# Altium project S7CAS-PLEIADES-CARTE-MERE_P02.PrjPCB (part 1 of 3)
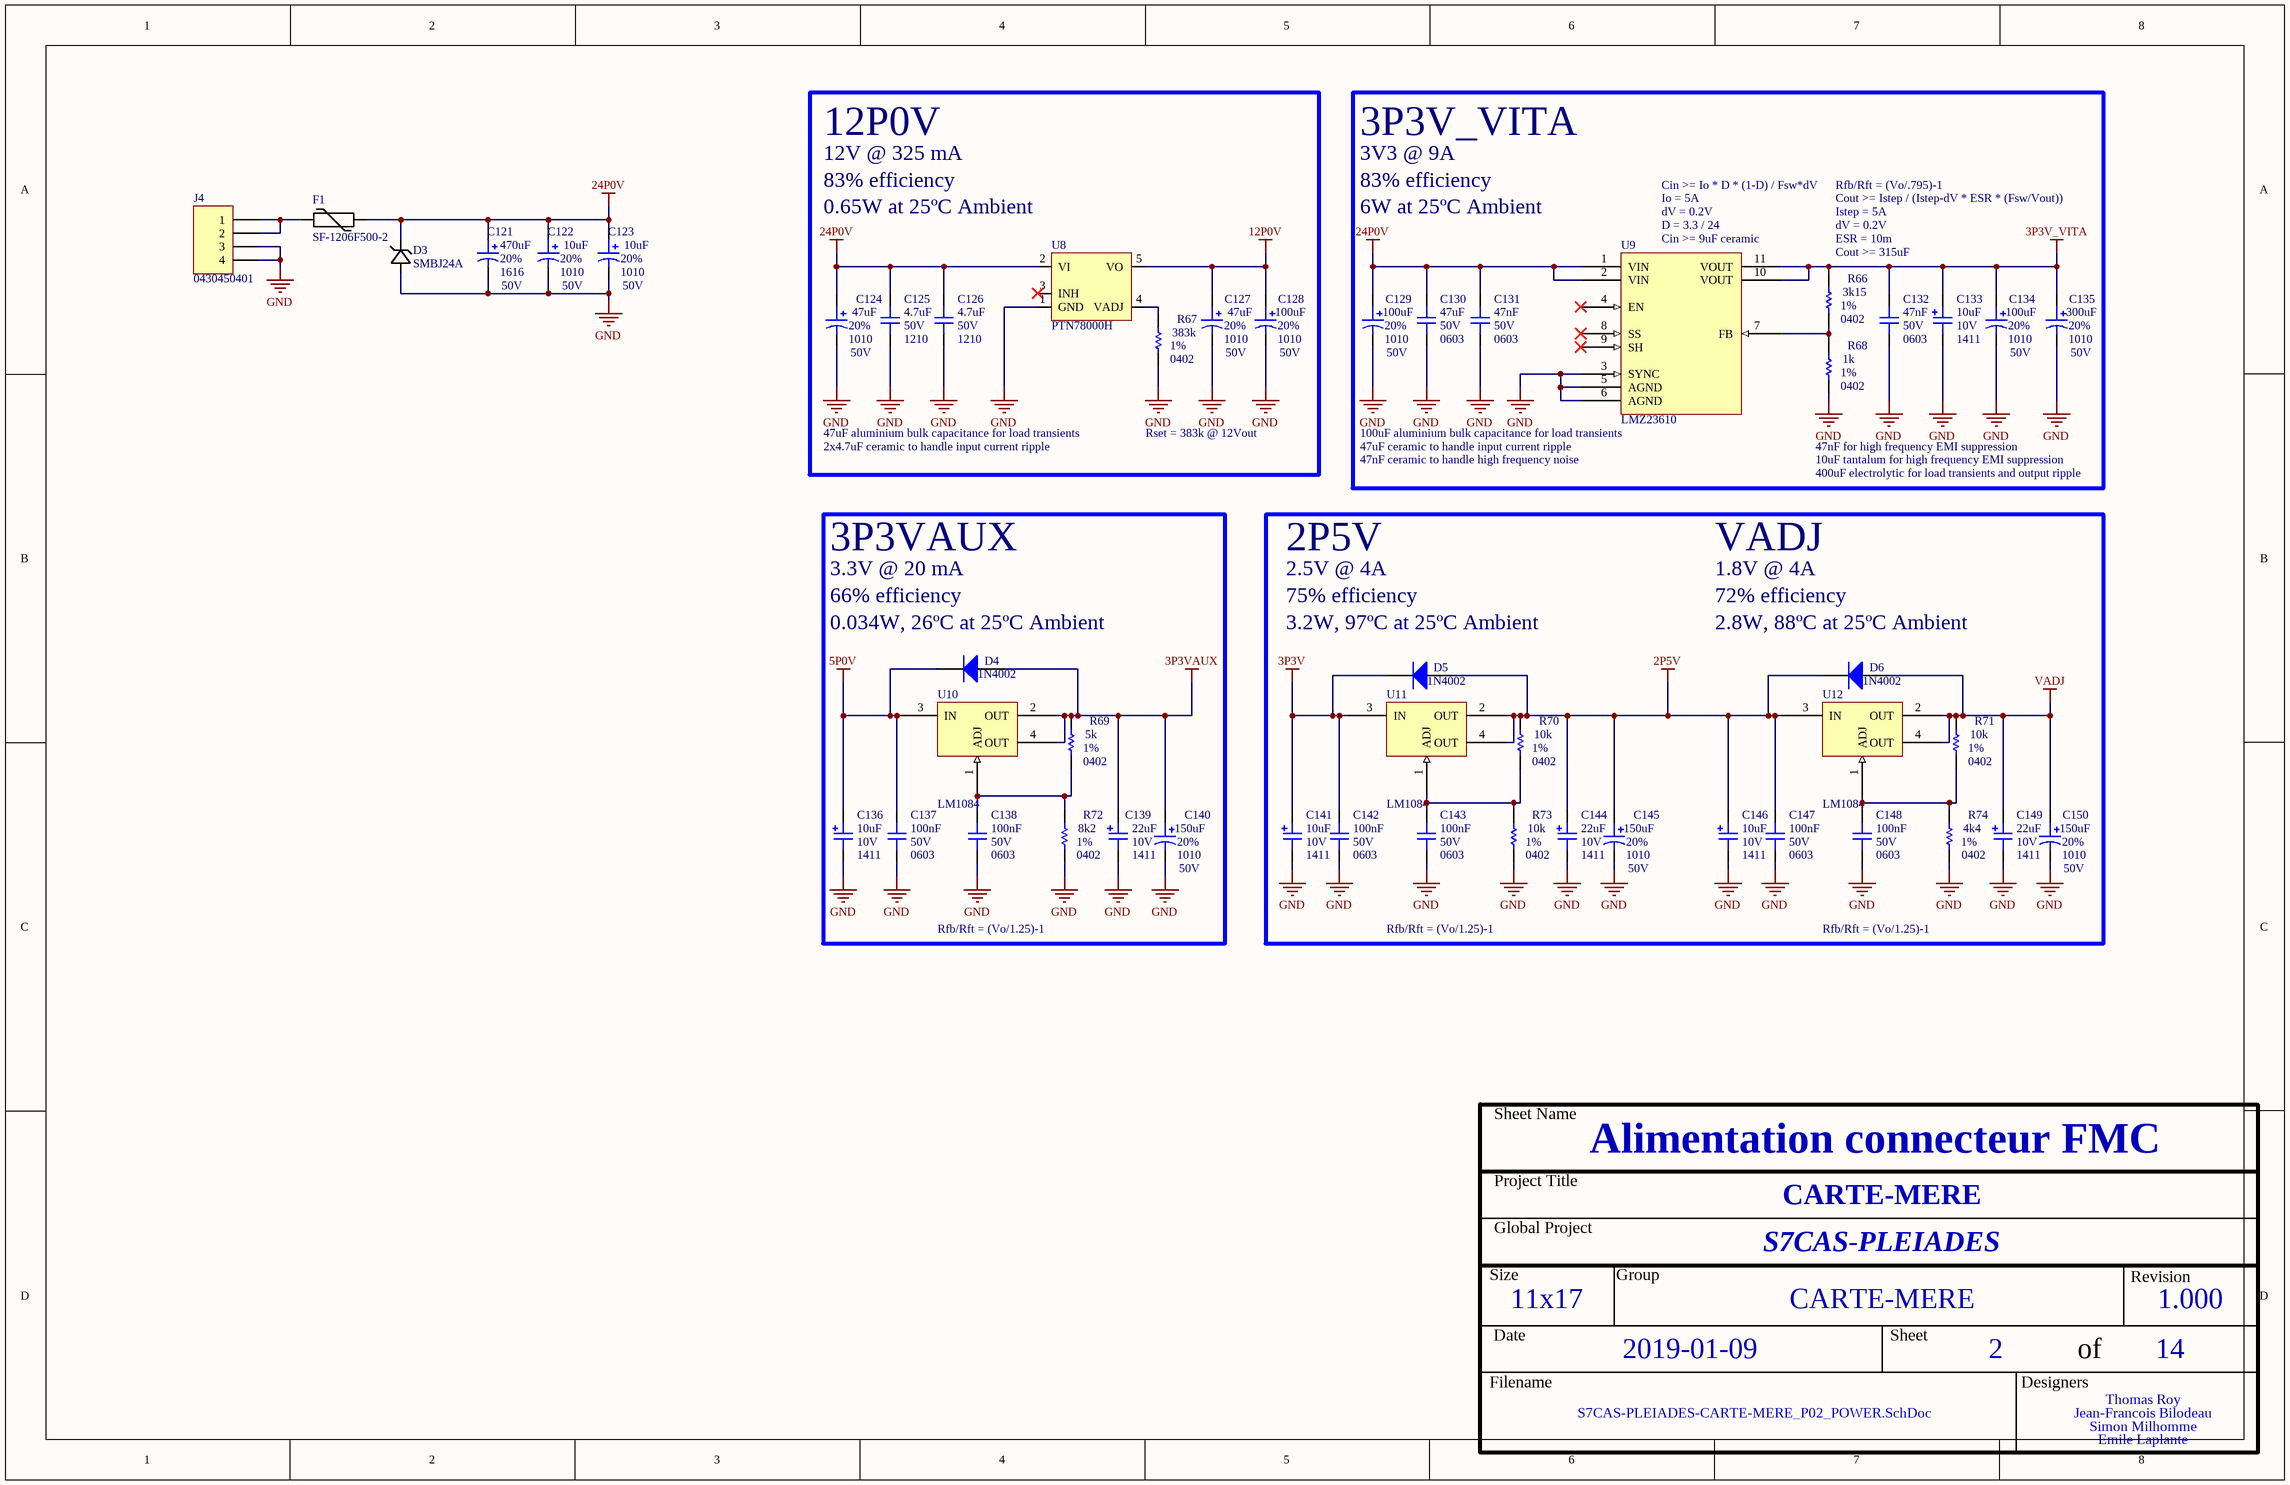
[diagram p0: S7CAS-PLEIADES-CARTE-MERE_P02_POWER.SchDoc]
Project_Date: 2019-01-09; Project_DateCode: DC1234; Project_Designer1: Thomas Roy; Project_Designer2: Jean-Francois Bilodeau; Project_Designer3: Simon Milhomme; Project_Designer4: Emile Laplante; Project_Global: S7CAS-PLEIADES; Project_Group: CARTE-MERE; Project_Name: CARTE-MERE; Project_Revision: 1.000; Project_Stencil_Bot_Thickness: 0.1 MM; Project_Stencil_Top_Thickness: 0.1 MM
13 sheets, 322 parts. Net scope: flat (ports and power ports of the same name join across sheets).
Board file: S7CAS-PLEIADES-CARTE-MERE_P02.PcbDoc
Sheets:
  S7CAS-PLEIADES-CARTE-MERE_P02_POWER.SchDoc
  S7CAS-PLEIADES-CARTE-MERE_P02_POWER_CARRIER.SchDoc
  S7CAS-PLEIADES-CARTE-MERE_P02_CONNECTORS.SchDoc
  S7CAS-PLEIADES-CARTE-MERE_P02_FPGA_B0B1.SchDoc
  S7CAS-PLEIADES-CARTE-MERE_P02_FPGA_B2B3.SchDoc
  S7CAS-PLEIADES-CARTE-MERE_P02_FPGA_B4B5.SchDoc
  S7CAS-PLEIADES-CARTE-MERE_P02_DDR3.SchDoc
  S7CAS-PLEIADES-CARTE-MERE_P02_MOTOR_CTRL.SchDoc
  S7CAS-PLEIADES-CARTE-MERE_P02_ETHERNET.SchDoc
  S7CAS-PLEIADES-CARTE-MERE_P02_USB.SchDoc
  S7CAS-PLEIADES-CARTE-MERE_P02_CLOCKS.SchDoc
  S7CAS-PLEIADES-CARTE-MERE_P02_FLASH.SchDoc
  S7CAS-PLEIADES-CARTE-MERE_P02_USER_IO.SchDoc

## Sheet S7CAS-PLEIADES-CARTE-MERE_P02_POWER.SchDoc
size Tabloid; DocumentNumber: 2; SheetNumber: 2; SheetTotal: 14; Size: 11x17; Sheet_Name: Alimentation connecteur FMC

### Parts
C121  value 470uF  Voltage: 50V  Package: 1616  Precision: 20%  [CAP_ALU_1616_vishay]  (hidden comment: MAL214699108E3)
C122  value 10uF  Voltage: 50V  Package: 1010  Precision: 20%  [CAP_ALU_1010_vishay]  (hidden comment: MAL215099101E3)
C123  value 10uF  Voltage: 50V  Package: 1010  Precision: 20%  [CAP_ALU_1010_vishay]  (hidden comment: MAL215099101E3)
C124  value 47uF  Voltage: 50V  Package: 1010  Precision: 20%  [CAP_ALU_1010_vishay]  (hidden comment: MAL215099101E3)
C125  value 4.7uF  Voltage: 50V  Package: 1210  [CAP_1210]  (hidden comment: CAP - 1210)
C126  value 4.7uF  Voltage: 50V  Package: 1210  [CAP_1210]  (hidden comment: CAP - 1210)
C127  value 47uF  Voltage: 50V  Package: 1010  Precision: 20%  [CAP_ALU_1010_vishay]  (hidden comment: MAL215099101E3)
C128  value 100uF  Voltage: 50V  Package: 1010  Precision: 20%  [CAP_ALU_1010_vishay]  (hidden comment: MAL215099101E3)
C129  value 100uF  Voltage: 50V  Package: 1010  Precision: 20%  [CAP_ALU_1010_vishay]  (hidden comment: MAL215099101E3)
C130  value 47uF  Voltage: 50V  Package: 0603  [CAP_0603]  (hidden comment: CAP - 0603)
C131  value 47nF  Voltage: 50V  Package: 0603  [CAP_0603]  (hidden comment: CAP - 0603)
C132  value 47nF  Voltage: 50V  Package: 0603  [CAP_0603]  (hidden comment: CAP - 0603)
C133  value 10uF  Voltage: 10V  Package: 1411  [CAP_TAN_1411(B)]  (hidden comment: CAP - TANTALUM - CASE B)
C134  value 100uF  Voltage: 50V  Package: 1010  Precision: 20%  [CAP_ALU_1010_vishay]  (hidden comment: MAL215099101E3)
C135  value 300uF  Voltage: 50V  Package: 1010  Precision: 20%  [CAP_ALU_1010_vishay]  (hidden comment: MAL215099101E3)
C136  value 10uF  Voltage: 10V  Package: 1411  [CAP_TAN_1411(B)]  (hidden comment: CAP - TANTALUM - CASE B)
C137  value 100nF  Voltage: 50V  Package: 0603  [CAP_0603]  (hidden comment: CAP - 0603)
C138  value 100nF  Voltage: 50V  Package: 0603  [CAP_0603]  (hidden comment: CAP - 0603)
C139  value 22uF  Voltage: 10V  Package: 1411  [CAP_TAN_1411(B)]  (hidden comment: CAP - TANTALUM - CASE B)
C140  value 150uF  Voltage: 50V  Package: 1010  Precision: 20%  [CAP_ALU_1010_vishay]  (hidden comment: MAL215099101E3)
C141  value 10uF  Voltage: 10V  Package: 1411  [CAP_TAN_1411(B)]  (hidden comment: CAP - TANTALUM - CASE B)
C142  value 100nF  Voltage: 50V  Package: 0603  [CAP_0603]  (hidden comment: CAP - 0603)
C143  value 100nF  Voltage: 50V  Package: 0603  [CAP_0603]  (hidden comment: CAP - 0603)
C144  value 22uF  Voltage: 10V  Package: 1411  [CAP_TAN_1411(B)]  (hidden comment: CAP - TANTALUM - CASE B)
C145  value 150uF  Voltage: 50V  Package: 1010  Precision: 20%  [CAP_ALU_1010_vishay]  (hidden comment: MAL215099101E3)
C146  value 10uF  Voltage: 10V  Package: 1411  [CAP_TAN_1411(B)]  (hidden comment: CAP - TANTALUM - CASE B)
C147  value 100nF  Voltage: 50V  Package: 0603  [CAP_0603]  (hidden comment: CAP - 0603)
C148  value 100nF  Voltage: 50V  Package: 0603  [CAP_0603]  (hidden comment: CAP - 0603)
C149  value 22uF  Voltage: 10V  Package: 1411  [CAP_TAN_1411(B)]  (hidden comment: CAP - TANTALUM - CASE B)
C150  value 150uF  Voltage: 50V  Package: 1010  Precision: 20%  [CAP_ALU_1010_vishay]  (hidden comment: MAL215099101E3)
D3  SMBJ24A  [DO-214AA]
D4  1N4002  [DO-41]
D5  1N4002  [DO-41]
D6  1N4002  [DO-41]
F1  SF-1206F500-2  [RES_1206]
J4  0430450401  [0430450401]
R66  value 3k15  Package: 0402  Precision: 1%  [RES_0402]  (hidden comment: RES - 0402)
R67  value 383k  Package: 0402  Precision: 1%  [RES_0402]  (hidden comment: RES - 0402)
R68  value 1k  Package: 0402  Precision: 1%  [RES_0402]  (hidden comment: RES - 0402)
R69  value 5k  Package: 0402  Precision: 1%  [RES_0402]  (hidden comment: RES - 0402)
R70  value 10k  Package: 0402  Precision: 1%  [RES_0402]  (hidden comment: RES - 0402)
R71  value 10k  Package: 0402  Precision: 1%  [RES_0402]  (hidden comment: RES - 0402)
R72  value 8k2  Package: 0402  Precision: 1%  [RES_0402]  (hidden comment: RES - 0402)
R73  value 10k  Package: 0402  Precision: 1%  [RES_0402]  (hidden comment: RES - 0402)
R74  value 4k4  Package: 0402  Precision: 1%  [RES_0402]  (hidden comment: RES - 0402)
U8  PTN78000H  [PTN78000W]
U9  LMZ23610  [NDY0011A]
U10  LM1084  [DPAK-3]
U11  LM1084  [DPAK-3]
U12  LM1084  [DPAK-3]

### Blocks framed on the sheet
12P0V: C124-C128 R67 U8
3P3V_VITA: C129-C135 R66 R68 U9
3P3VAUX: C136-C140 D4 R69 R72 U10

### Nets
2P5V: C144.2 C145.1 C146.2 C147.2 D5.1(A) D6.2(K) R70.2 U11.2(OUT) U11.4(OUT) U12.3(IN)
3P3V: C141.2 C142.2 D5.2(K) U11.3(IN)
3P3V_VITA: C132.2 C133.2 C134.1 C135.1 R66.2 U9.10(VOUT) U9.11(VOUT)
3P3VAUX: C139.2 C140.1 D4.1(A) R69.2 U10.2(OUT) U10.4(OUT)
5P0V: C136.2 C137.2 D4.2(K) U10.3(IN)
12P0V: C127.1 C128.1 U8.5(VO)
24P0V: C121.1 C122.1 C123.1 C124.1 C125.2 C126.2 C129.1 C130.2 C131.2 D3.1(C) F1.2 U8.2(VI) U9.1(VIN) U9.2(VIN)
GND: C121.2 C122.2 C123.2 C124.2 C125.1 C126.1 C127.2 C128.2 C129.2 C130.1 C131.1 C132.1 C133.1 C134.2 C135.2 C136.1 C137.1 C138.1 C139.1 C140.2 C141.1 C142.1 C143.1 C144.1 C145.2 C146.1 C147.1 C148.1 C149.1 C150.2 D3.2(A) J4.3 J4.4 R67.1 R68.1 R72.1 R73.1 R74.1 U8.1(GND) U9.3(SYNC) U9.5(AGND) U9.6(AGND)
VADJ: C149.2 C150.1 D6.1(A) R71.2 U12.2(OUT) U12.4(OUT)
NetC138_2: C138.2 R69.1 R72.2 U10.1(ADJ)
NetC143_2: C143.2 R70.1 R73.2 U11.1(ADJ)
NetC148_2: C148.2 R71.1 R74.2 U12.1(ADJ)
NetF1_1: F1.1 J4.1 J4.2
NetR66_1: R66.1 R68.2 U9.7(FB)
NetR67_2: R67.2 U8.4(VADJ)

Not connected (* = marked no-connect by the designer): U8 3(INH)*; U9 4(EN)* 8(SS)* 9(SH)*

### Notes on the sheet
- 12V @ 325 mA
- 3V3 @ 9A
- 83% efficiency
- (near U8) 0.65W at 25ºC Ambient
- 6W at 25ºC Ambient
- Cin >= Io * D * (1-D) / Fsw*dV
- Io = 5A
- (near U9) dV = 0.2V
- (near U9) D = 3.3 / 24
- Cout >= Istep / (Istep-dV * ESR * (Fsw/Vout))
- Istep = 5A
- dV = 0.2V
- Rfb/Rft = (Vo/.795)-1
- (near U9) Cin >= 9uF ceramic
- ESR = 10m
- (near R66) Cout >= 315uF
- 47uF aluminium bulk capacitance for load transients
- Rset = 383k @ 12Vout
- (near U9) 100uF aluminium bulk capacitance for load transients
- 2x4.7uF ceramic to handle input current ripple
- (near U9) 47uF ceramic to handle input current ripple
- 47nF ceramic to handle high frequency noise
- 47nF for high frequency EMI suppression
- 10uF tantalum for high frequency EMI suppression
- 400uF electrolytic for load transients and output ripple
- 2P5V
- VADJ
- 3.3V @ 20 mA
- 66% efficiency
- (near D4) 0.034W, 26ºC at 25ºC Ambient
- 2.5V @ 4A
- 75% efficiency
- (near D5) 3.2W, 97ºC at 25ºC Ambient
- 1.8V @ 4A
- 72% efficiency
- (near D6) 2.8W, 88ºC at 25ºC Ambient
- Rfb/Rft = (Vo/1.25)-1
- Sheet Name
- Project Title
- Global Project
- Size
- Group
- Revision
- Date
- Sheet
- of
- Filename
- Designers

### Library data of the parts
C121 = CAP_ALU_MAL214699108E3: CAP - ALU 470uF 20% 50V - 1616; Current: 1.3A; Mfg: Vishay Dale; Mfg Part Number: MAL214699108E3; HelpURL: http://www.vishay.com/docs/28403/146cti.pdf; CreatedBy: Jonathan Bouchard; Temperature: -55°C to 125°C; Power: *; Supplier 1: Digikey; Supplier Part Number 1: 4442PHCT-ND
C122 C123 C128 C129 C134 C135 C140 C145 C150 = CAP_ALU_MAL215099101E3: CAP - ALU 100uF 20% 50V - 1010; Current: 490mA; Mfg: Vishay Dale; Mfg Part Number: MAL215099101E3; HelpURL: http://www.vishay.com/docs/28395/150crz.pdf; CreatedBy: Jonathan Bouchard; Temperature: -55°C to 125°C; Power: *; Supplier 1: Digikey; Supplier Part Number 1: 4399PHDKR-ND
C124 C127 = CAP_ALU_MAL215099101E3: CAP - ALU 47uF 20% 50V - 1010; Current: 490mA; Mfg: Vishay Dale; Mfg Part Number: MAL215099101E3; HelpURL: http://www.vishay.com/docs/28395/150crz.pdf; CreatedBy: Jonathan Bouchard; Temperature: -55°C to 125°C; Power: *; Supplier 1: Digikey; Supplier Part Number 1: 4399PHDKR-ND
C125 C126 = CAP - 1210: Precision: 10%; Current: *; CreatedBy: Jonathan Bouchard; Power: *
C130-C132 C137 C138 C142 C143 C147 C148 = CAP - 0603: Precision: 10%; Current: *; CreatedBy: Jonathan Bouchard; Power: *
C133 C136 C139 C141 C144 C146 C149 = CAP_TANT_1411(B): CAP - TANTALUM - 1411; Precision: 10%; Current: *; CreatedBy: Jonathan Bouchard; Power: *
D3 = SMBJ24A: Vf: 24V; Imax: 15.5A; Pd: 600W
D4-D6 = Diode 1N4002: 1 Amp General Purpose Rectifier; Published: 8-Jun-2000; LatestRevisionDate: 17-Jul-2002; LatestRevisionNote: Re-released for DXP Platform.; DatasheetVersion: 1998; PackageVersion: Aug-1999; PackageReference: DO-41; Publisher: Altium Limited; PackageDescription: Diode, Axial; Body 5.2 x 2.7 mm (LxDia. max), Lead Dia. 0.86 mm (max); Code_JEDEC: DO-204-AL; ComponentLink1Description: Manufacturer Link; ComponentLink1URL: http://www.fairchildsemi.com/; ComponentLink2Description: Datasheet; ComponentLink2URL: http://www.fairchildsemi.com/ds/1N%2F1N4001.pdf
F1 = SF-1206F500-2: Manufacturer: Bourns Inc.; Itrip: 5A; Voltage: 24V; Footprint: 1206; Part Number: SF-1206F500-2
J4 = Header 4: Header, 4-Pin; Manufacturer: Molex; Imax: 8A; LatestRevisionDate: 17-Jul-2002; LatestRevisionNote: Re-released for DXP Platform.; Publisher: Altium Limited; Part Number: 0430450401
R66 R68-R74 = RES - 0402: Voltage: 50V; Power: 1/16W; Current: *; CreatedBy: Jonathan Bouchard
R67 = RES - 0402: RES - 0402 - 1/16W; Voltage: 50V; Current: *; CreatedBy: Jonathan Bouchard; Power: 1/16W
U8 = PTN78000H: XXX - 1.5-A, / WIDE-INPUT / ADJUSTABLE / SWITCHING / REGULATOR - Package; GRAMS Lib Spec: 2.7

## Sheet S7CAS-PLEIADES-CARTE-MERE_P02_POWER_CARRIER.SchDoc
size Tabloid; DocumentNumber: 3; SheetNumber: 3; SheetTotal: 14; Size: 11x17; Sheet_Name: Alimentation carte-mère
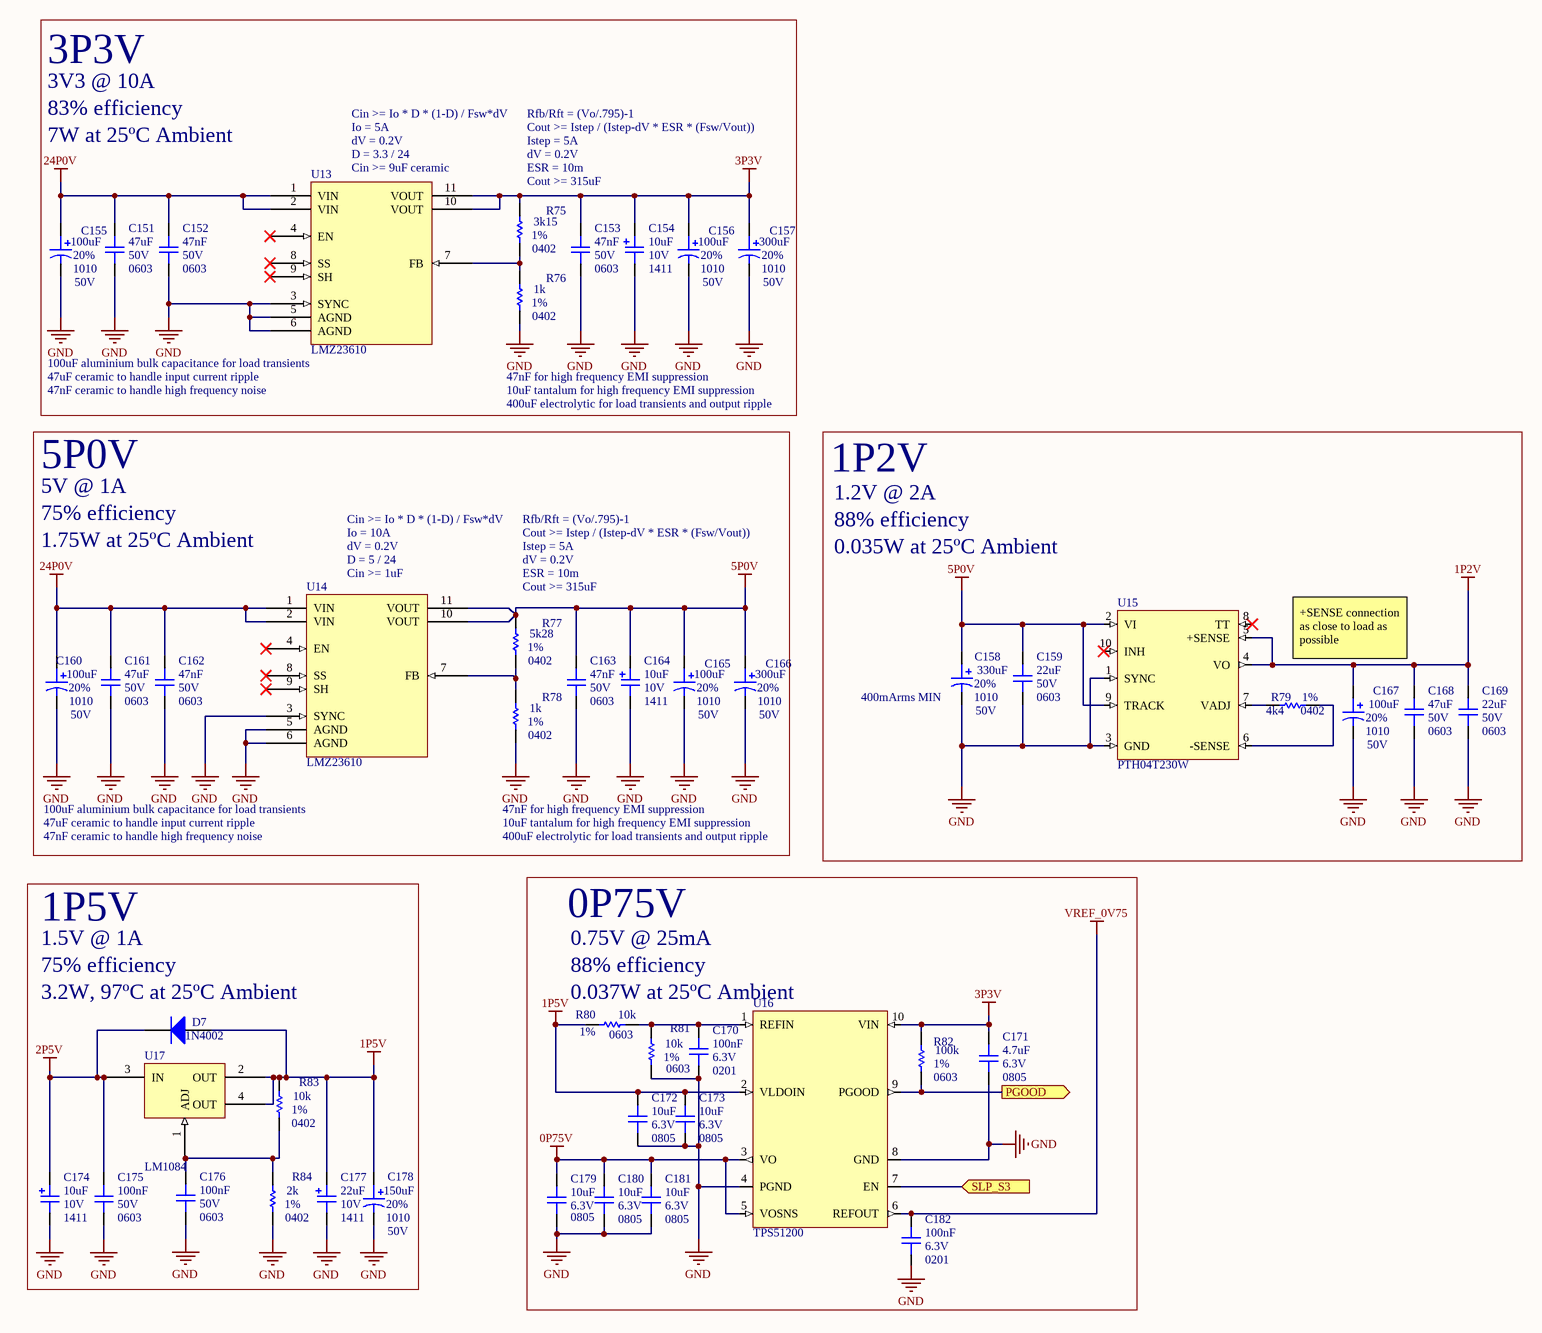
[diagram p1: S7CAS-PLEIADES-CARTE-MERE_P02_POWER_CARRIER.SchDoc]

### Parts
C151  value 47uF  Voltage: 50V  Package: 0603  [CAP_0603]  (hidden comment: CAP - 0603)
C152  value 47nF  Voltage: 50V  Package: 0603  [CAP_0603]  (hidden comment: CAP - 0603)
C153  value 47nF  Voltage: 50V  Package: 0603  [CAP_0603]  (hidden comment: CAP - 0603)
C154  value 10uF  Voltage: 10V  Package: 1411  [CAP_TAN_1411(B)]  (hidden comment: CAP - TANTALUM - CASE B)
C155  value 100uF  Voltage: 50V  Package: 1010  Precision: 20%  [CAP_ALU_1010_vishay]  (hidden comment: MAL215099101E3)
C156  value 100uF  Voltage: 50V  Package: 1010  Precision: 20%  [CAP_ALU_1010_vishay]  (hidden comment: MAL215099101E3)
C157  value 300uF  Voltage: 50V  Package: 1010  Precision: 20%  [CAP_ALU_1010_vishay]  (hidden comment: MAL215099101E3)
C158  value 330uF  Voltage: 50V  Package: 1010  Precision: 20%  [CAP_ALU_1010_vishay]  (hidden comment: MAL215099101E3)
C159  value 22uF  Voltage: 50V  Package: 0603  [CAP_0603]  (hidden comment: CAP - 0603)
C160  value 100uF  Voltage: 50V  Package: 1010  Precision: 20%  [CAP_ALU_1010_vishay]  (hidden comment: MAL215099101E3)
C161  value 47uF  Voltage: 50V  Package: 0603  [CAP_0603]  (hidden comment: CAP - 0603)
C162  value 47nF  Voltage: 50V  Package: 0603  [CAP_0603]  (hidden comment: CAP - 0603)
C163  value 47nF  Voltage: 50V  Package: 0603  [CAP_0603]  (hidden comment: CAP - 0603)
C164  value 10uF  Voltage: 10V  Package: 1411  [CAP_TAN_1411(B)]  (hidden comment: CAP - TANTALUM - CASE B)
C165  value 100uF  Voltage: 50V  Package: 1010  Precision: 20%  [CAP_ALU_1010_vishay]  (hidden comment: MAL215099101E3)
C166  value 300uF  Voltage: 50V  Package: 1010  Precision: 20%  [CAP_ALU_1010_vishay]  (hidden comment: MAL215099101E3)
C167  value 100uF  Voltage: 50V  Package: 1010  Precision: 20%  [CAP_ALU_1010_vishay]  (hidden comment: MAL215099101E3)
C168  value 47uF  Voltage: 50V  Package: 0603  [CAP_0603]  (hidden comment: CAP - 0603)
C169  value 22uF  Voltage: 50V  Package: 0603  [CAP_0603]  (hidden comment: CAP - 0603)
C170  value 100nF  Voltage: 6.3V  Package: 0201  [CAP_0201]  (hidden comment: CAP - 0201)
C171  value 4.7uF  Voltage: 6.3V  Package: 0805  [CAP_0805]  (hidden comment: CAP - 0805)
C172  value 10uF  Voltage: 6.3V  Package: 0805  [CAP_0805]  (hidden comment: CAP - 0805)
C173  value 10uF  Voltage: 6.3V  Package: 0805  [CAP_0805]  (hidden comment: CAP - 0805)
C174  value 10uF  Voltage: 10V  Package: 1411  [CAP_TAN_1411(B)]  (hidden comment: CAP - TANTALUM - CASE B)
C175  value 100nF  Voltage: 50V  Package: 0603  [CAP_0603]  (hidden comment: CAP - 0603)
C176  value 100nF  Voltage: 50V  Package: 0603  [CAP_0603]  (hidden comment: CAP - 0603)
C177  value 22uF  Voltage: 10V  Package: 1411  [CAP_TAN_1411(B)]  (hidden comment: CAP - TANTALUM - CASE B)
C178  value 150uF  Voltage: 50V  Package: 1010  Precision: 20%  [CAP_ALU_1010_vishay]  (hidden comment: MAL215099101E3)
C179  value 10uF  Voltage: 6.3V  Package: 0805  [CAP_0805]  (hidden comment: CAP - 0805)
C180  value 10uF  Voltage: 6.3V  Package: 0805  [CAP_0805]  (hidden comment: CAP - 0805)
C181  value 10uF  Voltage: 6.3V  Package: 0805  [CAP_0805]  (hidden comment: CAP - 0805)
C182  value 100nF  Voltage: 6.3V  Package: 0201  [CAP_0201]  (hidden comment: CAP - 0201)
D7  1N4002  [DO-41]
R75  value 3k15  Package: 0402  Precision: 1%  [RES_0402]  (hidden comment: RES - 0402)
R76  value 1k  Package: 0402  Precision: 1%  [RES_0402]  (hidden comment: RES - 0402)
R77  value 5k28  Package: 0402  Precision: 1%  [RES_0402]  (hidden comment: RES - 0402)
R78  value 1k  Package: 0402  Precision: 1%  [RES_0402]  (hidden comment: RES - 0402)
R79  value 4k4  Package: 0402  Precision: 1%  [RES_0402]  (hidden comment: RES - 0402)
R80  value 10k  Package: 0603  Precision: 1%  [RES_0402]  (hidden comment: RES - 0603)
R81  value 10k  Package: 0603  Precision: 1%  [RES_0402]  (hidden comment: RES - 0603)
R82  value 100k  Package: 0603  Precision: 1%  [RES_0402]  (hidden comment: RES - 0603)
R83  value 10k  Package: 0402  Precision: 1%  [RES_0402]  (hidden comment: RES - 0402)
R84  value 2k  Package: 0402  Precision: 1%  [RES_0402]  (hidden comment: RES - 0402)
U13  LMZ23610  [NDY0011A]
U14  LMZ23610  [NDY0011A]
U15  PTH04T230W  [PTH04T230W]
U16  TPS51200  [VSON-10]
U17  LM1084  [DPAK-3]

### Blocks framed on the sheet
3P3V: C151-C157 R75 R76 U13
5P0V: C160-C166 R77 R78 U14
1P2V: C158 C159 C167-C169 R79 U15
1P5V: C174-C178 D7 R83 R84 U17
0P75V: C170-C173 C179-C182 R80-R82 U16

### Ports
PGOOD (out), SLP_S3 (in)

### Nets
0P75V: C179.2 C180.2 C181.2 U16.3(VO) U16.5(VOSNS)
1P2V: C167.1 C168.2 C169.2 U15.4(VO) U15.5(+SENSE)
1P5V: C172.2 C173.2 C177.2 C178.1 D7.1(A) R80.2 R83.2 U16.2(VLDOIN) U17.2(OUT) U17.4(OUT)
2P5V: C174.2 C175.2 D7.2(K) U17.3(IN)
3P3V: C153.2 C154.2 C156.1 C157.1 C171.2 R75.2 R82.2 U13.10(VOUT) U13.11(VOUT) U16.10(VIN)
5P0V: C158.1 C159.2 C163.2 C164.2 C165.1 C166.1 R77.2 U14.10(VOUT) U14.11(VOUT) U15.2(VI) U15.9(TRACK)
24P0V: C151.2 C152.2 C155.1 C160.1 C161.2 C162.2 U13.1(VIN) U13.2(VIN) U14.1(VIN) U14.2(VIN)
GND: C151.1 C152.1 C153.1 C154.1 C155.2 C156.2 C157.2 C158.2 C159.1 C160.2 C161.1 C162.1 C163.1 C164.1 C165.2 C166.2 C167.2 C168.1 C169.1 C170.1 C171.1 C172.1 C173.1 C174.1 C175.1 C176.1 C177.1 C178.2 C179.1 C180.1 C181.1 R76.1 R78.1 R81.1 R84.1 U13.3(SYNC) U13.5(AGND) U13.6(AGND) U14.3(SYNC) U14.5(AGND) U14.6(AGND) U15.1(SYNC) U15.3(GND) U16.4(PGND) U16.8(GND)
VREF_0V75: C182.2 U16.6(REFOUT)
PGOOD: R82.1 U16.9(PGOOD) ; port PGOOD
SLP_S3: U16.7(EN) ; port SLP_S3
NetC170_2: C170.2 R80.1 R81.2 U16.1(REFIN)
NetC176_2: C176.2 R83.1 R84.2 U17.1(ADJ)
NetR75_1: R75.1 R76.2 U13.7(FB)
NetR77_1: R77.1 R78.2 U14.7(FB)
NetR79_1: R79.1 U15.6(-SENSE)
NetR79_2: R79.2 U15.7(VADJ)

Not connected (* = marked no-connect by the designer): C182 1; U13 4(EN)* 8(SS)* 9(SH)*; U14 4(EN)* 8(SS)* 9(SH)*; U15 8(TT)* 10(INH)*

### Notes on the sheet
- 3V3 @ 10A
- 83% efficiency
- Cin >= Io * D * (1-D) / Fsw*dV
- Rfb/Rft = (Vo/.795)-1
- 7W at 25ºC Ambient
- Io = 5A
- (near U13) dV = 0.2V
- (near U13) Cin >= 9uF ceramic
- (near U13) D = 3.3 / 24
- Cout >= Istep / (Istep-dV * ESR * (Fsw/Vout))
- Istep = 5A
- dV = 0.2V
- ESR = 10m
- (near R75) Cout >= 315uF
- (near U13) 47uF ceramic to handle input current ripple
- (near U13) 100uF aluminium bulk capacitance for load transients
- 47nF for high frequency EMI suppression
- 47nF ceramic to handle high frequency noise
- 10uF tantalum for high frequency EMI suppression
- 400uF electrolytic for load transients and output ripple
- 5V @ 1A
- 75% efficiency
- 1.2V @ 2A
- 1.75W at 25ºC Ambient
- Io = 10A
- (near U14) Cin >= 1uF
- (near U14) D = 5 / 24
- (near R77) ESR = 10m
- (near R77) Cout >= 315uF
- 88% efficiency
- 0.035W at 25ºC Ambient
- +SENSE connection as close to load as possible
- (near C158) 400mArms MIN
- 47uF ceramic to handle input current ripple
- 100uF aluminium bulk capacitance for load transients
- 1.5V @ 1A
- (near D7) 75% efficiency
- 0.75V @ 25mA
- (near D7) 3.2W, 97ºC at 25ºC Ambient
- 0.037W at 25ºC Ambient
- Labels drawn without touching a wire or pin: GND
- Sheet Name
- Project Title
- Global Project
- Size
- Group
- Revision
- Date
- Sheet
- of
- Filename
- Designers

### Library data of the parts
C151-C153 C159 C161-C163 C168 C169 C175 C176 = CAP - 0603: Precision: 10%; Current: *; CreatedBy: Jonathan Bouchard; Power: *
C154 C164 C174 C177 = CAP_TANT_1411(B): CAP - TANTALUM - 1411; Precision: 10%; Current: *; CreatedBy: Jonathan Bouchard; Power: *
C155-C158 C160 C165-C167 C178 = CAP_ALU_MAL215099101E3: as C122 on sheet S7CAS-PLEIADES-CARTE-MERE_P02_POWER; Mfg Part Number: MAL215099101E3; HelpURL: http://www.vishay.com/docs/28395/150crz.pdf; CreatedBy: Jonathan Bouchard; Temperature: -55°C to 125°C; Power: *; Supplier 1: Digikey; Supplier Part Number 1: 4399PHDKR-ND
C170 C182 = CAP - 0201: Precision: 10%; Current: *; CreatedBy: Jonathan Bouchard; Power: *
C171-C173 C179-C181 = CAP - 0805: Precision: 10%; Current: *; CreatedBy: Jonathan Bouchard; Power: *
D7 = Diode 1N4002: 1 Amp General Purpose Rectifier; Published: 8-Jun-2000; LatestRevisionDate: 17-Jul-2002; LatestRevisionNote: Re-released for DXP Platform.; DatasheetVersion: 1998; PackageVersion: Aug-1999; PackageReference: DO-41; Publisher: Altium Limited; PackageDescription: Diode, Axial; Body 5.2 x 2.7 mm (LxDia. max), Lead Dia. 0.86 mm (max); Code_JEDEC: DO-204-AL; ComponentLink1Description: Manufacturer Link; ComponentLink1URL: http://www.fairchildsemi.com/; ComponentLink2Description: Datasheet; ComponentLink2URL: http://www.fairchildsemi.com/ds/1N%2F1N4001.pdf
R75-R79 R83 R84 = RES - 0402: Voltage: 50V; Power: 1/16W; Current: *; CreatedBy: Jonathan Bouchard
U15 = PTH04T230W: XXX - Description - Package; GRAMS Lib Spec: 2.7
U16 = TPS51200: TPS51200 / Sink and Source / DDR Termination / Regulator
R80-R82 = RES - 0603: Current: *; CreatedBy: Jonathan Bouchard

## Sheet S7CAS-PLEIADES-CARTE-MERE_P02_CONNECTORS.SchDoc
size Tabloid; DocumentNumber: 4; SheetNumber: 4; SheetTotal: 14; Size: 11x17; Sheet_Name: Connecteur FMC
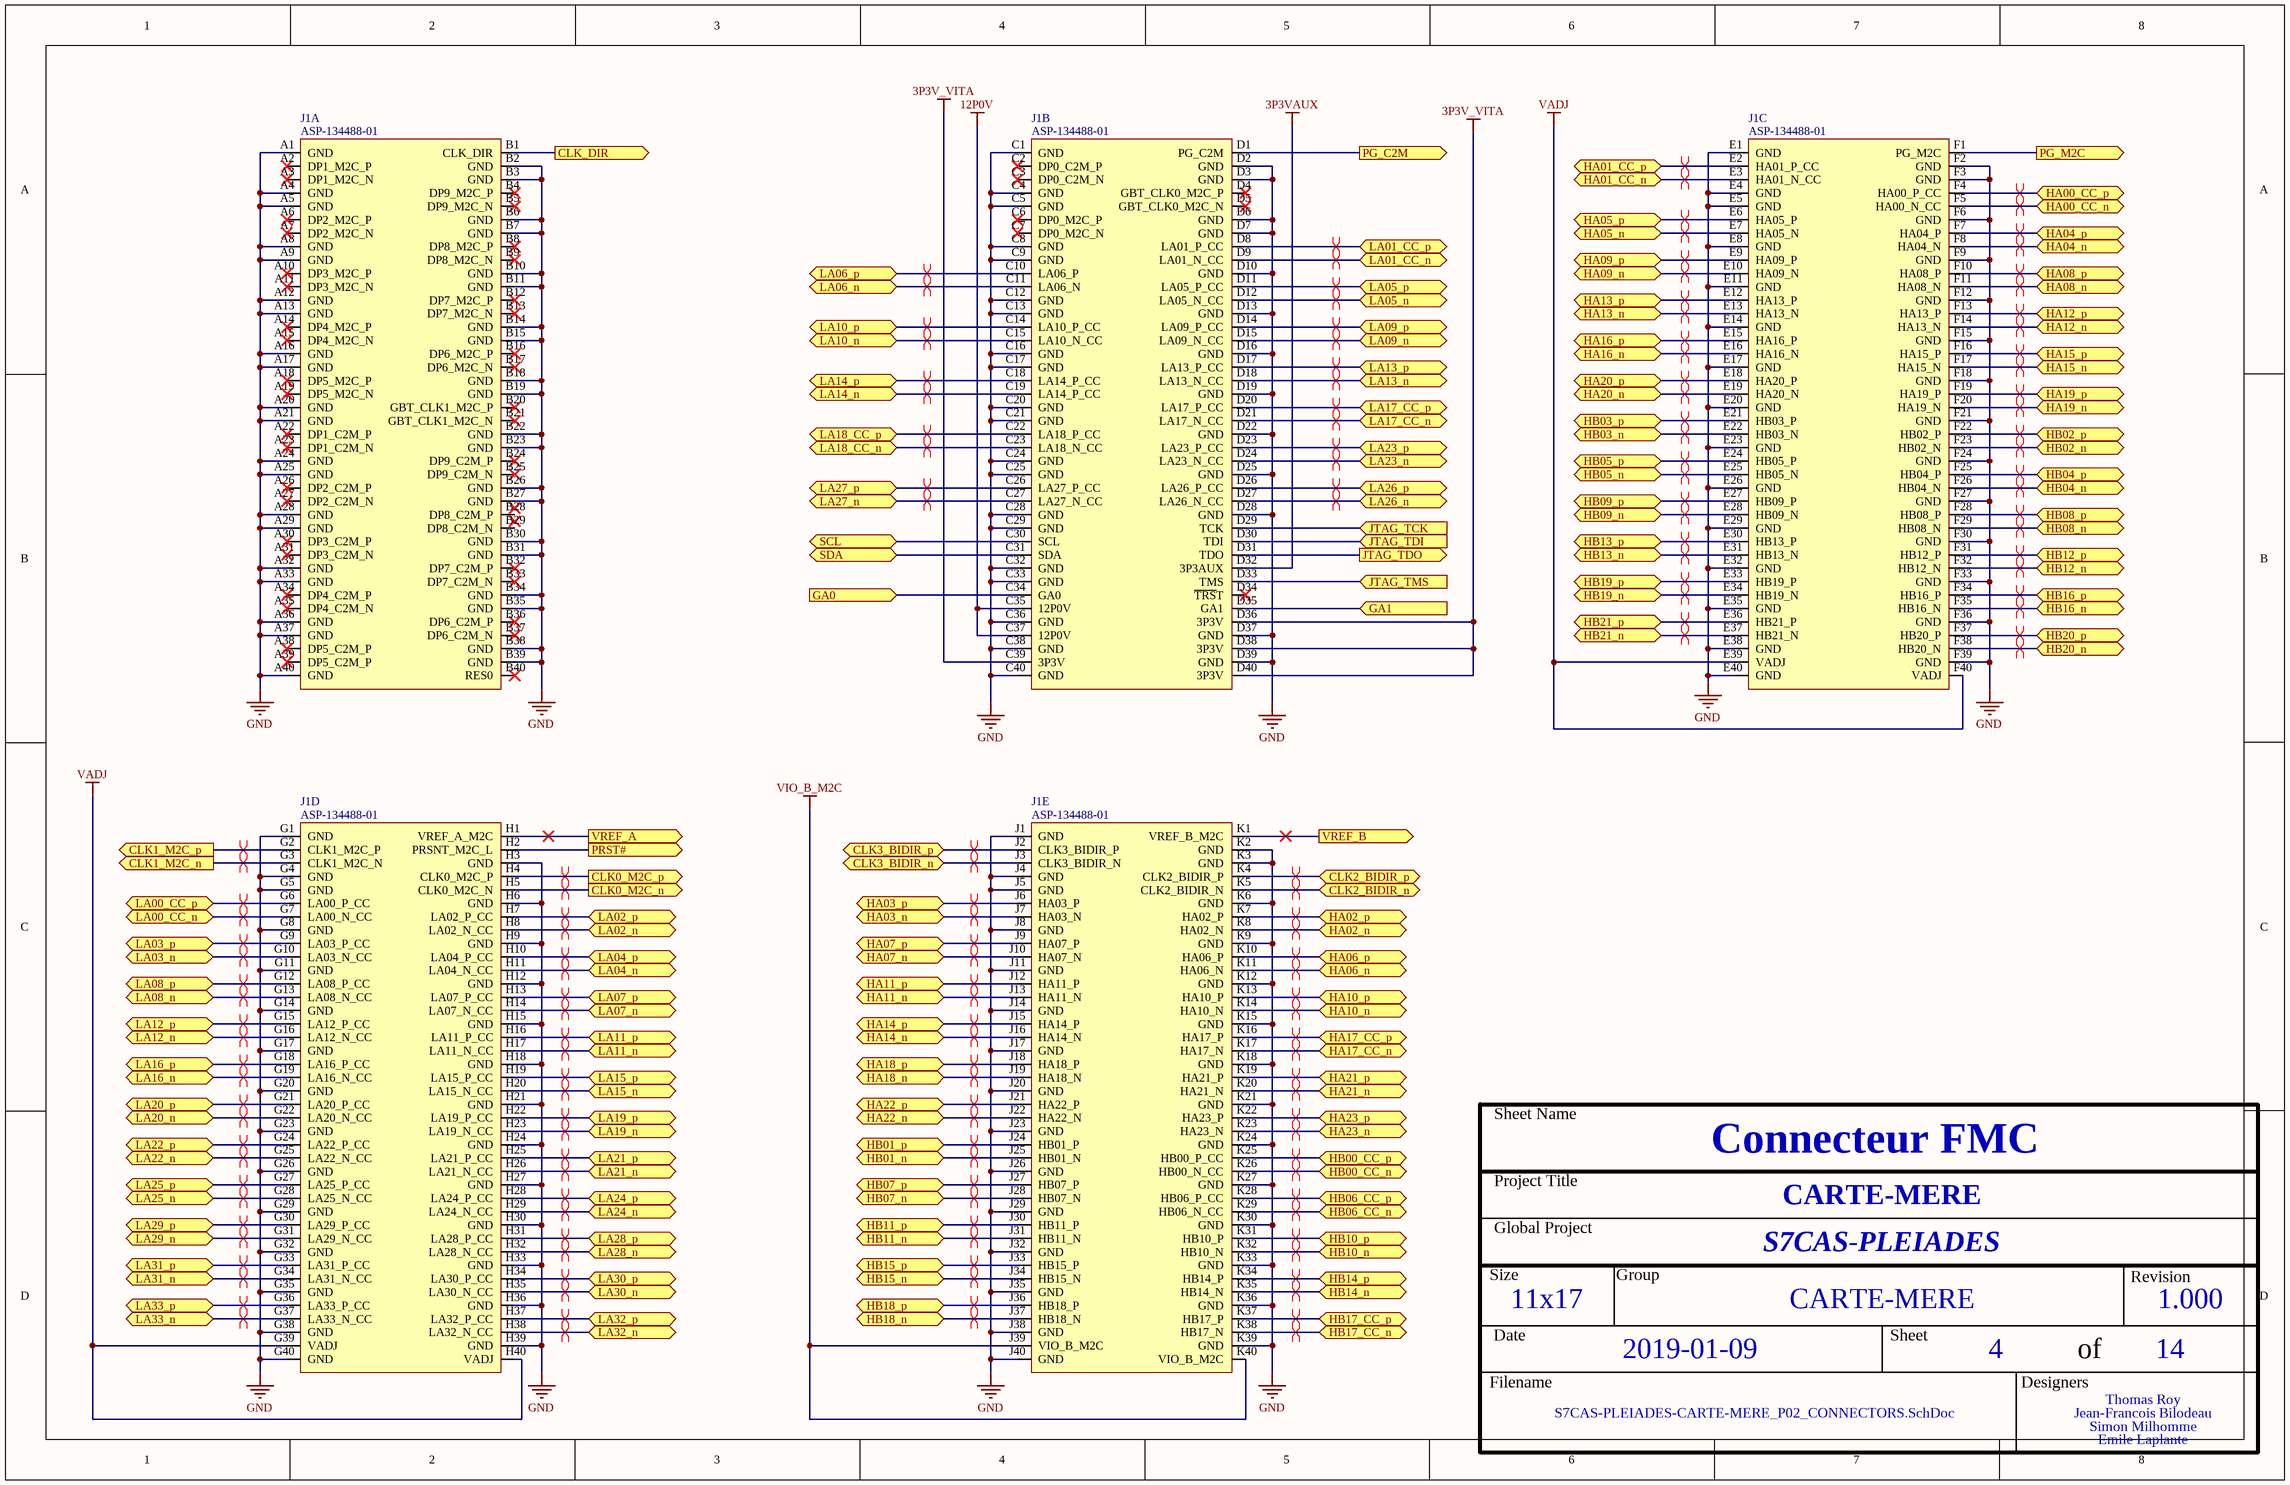
[diagram p2: S7CAS-PLEIADES-CARTE-MERE_P02_CONNECTORS.SchDoc]

### Parts
J1  ASP-134488-01  [CONN_SAMTEC_ASP-134488-01]  (parts A,B,C,D,E of 5)

### Ports
CLK0_M2C_n (out), CLK0_M2C_p (out), CLK1_M2C_n (out), CLK1_M2C_p (out), CLK2_BIDIR_n (bidir), CLK2_BIDIR_p (bidir), CLK3_BIDIR_n (bidir), CLK3_BIDIR_p (bidir), CLK_DIR (out), GA0 (in), GA1 (in), HA00_CC_n (bidir), HA00_CC_p (bidir), HA01_CC_n (bidir), HA01_CC_p (bidir), HA02_n (bidir), HA02_p (bidir), HA03_n (bidir), HA03_p (bidir), HA04_n (bidir), HA04_p (bidir), HA05_n (bidir), HA05_p (bidir), HA06_n (bidir), HA06_p (bidir), HA07_n (bidir), HA07_p (bidir), HA08_n (bidir), HA08_p (bidir), HA09_n (bidir), HA09_p (bidir), HA10_n (bidir), HA10_p (bidir), HA11_n (bidir), HA11_p (bidir), HA12_n (bidir), HA12_p (bidir), HA13_n (bidir), HA13_p (bidir), HA14_n (bidir), HA14_p (bidir), HA15_n (bidir), HA15_p (bidir), HA16_n (bidir), HA16_p (bidir), HA17_CC_n (bidir), HA17_CC_p (bidir), HA18_n (bidir), HA18_p (bidir), HA19_n (bidir), HA19_p (bidir), HA20_n (bidir), HA20_p (bidir), HA21_n (bidir), HA21_p (bidir), HA22_n (bidir), HA22_p (bidir), HA23_n (bidir), HA23_p (bidir), HB00_CC_n (bidir), HB00_CC_p (bidir), HB01_n (bidir), HB01_p (bidir), HB02_n (bidir), HB02_p (bidir), HB03_n (bidir), HB03_p (bidir), HB04_n (bidir), HB04_p (bidir), HB05_n (bidir), HB05_p (bidir), HB06_CC_n (bidir), HB06_CC_p (bidir), HB07_n (bidir), HB07_p (bidir), HB08_n (bidir), HB08_p (bidir), HB09_n (bidir), HB09_p (bidir), HB10_n (bidir), HB10_p (bidir), HB11_n (bidir), HB11_p (bidir), HB12_n (bidir), HB12_p (bidir), HB13_n (bidir), HB13_p (bidir), HB14_n (bidir), HB14_p (bidir), HB15_n (bidir), HB15_p (bidir), HB16_n (bidir), HB16_p (bidir), HB17_CC_n (bidir), HB17_CC_p (bidir), HB18_n (bidir), HB18_p (bidir), HB19_n (bidir), HB19_p (bidir), HB20_n (bidir), HB20_p (bidir), HB21_n (bidir), HB21_p (bidir), JTAG_TCK (in), JTAG_TDI (in), JTAG_TDO (out), JTAG_TMS (in), LA00_CC_n (bidir), LA00_CC_p (bidir), LA01_CC_n (bidir), LA01_CC_p (bidir), LA02_n (bidir), LA02_p (bidir), LA03_n (bidir), LA03_p (bidir), LA04_n (bidir), LA04_p (bidir), LA05_n (bidir), LA05_p (bidir), LA06_n (bidir), LA06_p (bidir), LA07_n (bidir), LA07_p (bidir), LA08_n (bidir), LA08_p (bidir), LA09_n (bidir), LA09_p (bidir), LA10_n (bidir), LA10_p (bidir), LA11_n (bidir), LA11_p (bidir), LA12_n (bidir), LA12_p (bidir), LA13_n (bidir), LA13_p (bidir), LA14_n (bidir), LA14_p (bidir), LA15_n (bidir), LA15_p (bidir), LA16_n (bidir), LA16_p (bidir), LA17_CC_n (bidir), LA17_CC_p (bidir), LA18_CC_n (bidir), LA18_CC_p (bidir), LA19_n (bidir), LA19_p (bidir), LA20_n (bidir), LA20_p (bidir), LA21_n (bidir), LA21_p (bidir), LA22_n (bidir), LA22_p (bidir), LA23_n (bidir), LA23_p (bidir), LA24_n (bidir), LA24_p (bidir), LA25_n (bidir), LA25_p (bidir), LA26_n (bidir), LA26_p (bidir), LA27_n (bidir), LA27_p (bidir), LA28_n (bidir), LA28_p (bidir), LA29_n (bidir), LA29_p (bidir), LA30_n (bidir), LA30_p (bidir), LA31_n (bidir), LA31_p (bidir), LA32_n (bidir), LA32_p (bidir), LA33_n (bidir), LA33_p (bidir), PG_C2M (out), PG_M2C (out), PRST# (out), SCL (bidir), SDA (bidir), VREF_A (out), VREF_B (out)

### Nets
3P3V_VITA: J1.C39(3P3V) J1.D36(3P3V) J1.D38(3P3V) J1.D40(3P3V)
3P3VAUX: J1.D32(3P3AUX)
12P0V: J1.C35(12P0V) J1.C37(12P0V)
GND: J1.A1(GND) J1.A4(GND) J1.A5(GND) J1.A8(GND) J1.A9(GND) J1.A12(GND) J1.A13(GND) J1.A16(GND) J1.A17(GND) J1.A20(GND) J1.A21(GND) J1.A24(GND) J1.A25(GND) J1.A28(GND) J1.A29(GND) J1.A32(GND) J1.A33(GND) J1.A36(GND) J1.A37(GND) J1.A40(GND) J1.B2(GND) J1.B3(GND) J1.B6(GND) J1.B7(GND) J1.B10(GND) J1.B11(GND) J1.B14(GND) J1.B15(GND) J1.B18(GND) J1.B19(GND) J1.B22(GND) J1.B23(GND) J1.B26(GND) J1.B27(GND) J1.B30(GND) J1.B31(GND) J1.B34(GND) J1.B35(GND) J1.B38(GND) J1.B39(GND) J1.C1(GND) J1.C4(GND) J1.C5(GND) J1.C8(GND) J1.C9(GND) J1.C12(GND) J1.C13(GND) J1.C16(GND) J1.C17(GND) J1.C20(GND) J1.C21(GND) J1.C24(GND) J1.C25(GND) J1.C28(GND) J1.C29(GND) J1.C32(GND) J1.C33(GND) J1.C36(GND) J1.C38(GND) J1.C40(GND) J1.D2(GND) J1.D3(GND) J1.D6(GND) J1.D7(GND) J1.D10(GND) J1.D13(GND) J1.D16(GND) J1.D19(GND) J1.D22(GND) J1.D25(GND) J1.D28(GND) J1.D37(GND) J1.D39(GND) J1.E1(GND) J1.E4(GND) J1.E5(GND) J1.E8(GND) J1.E11(GND) J1.E14(GND) J1.E17(GND) J1.E20(GND) J1.E23(GND) J1.E26(GND) J1.E29(GND) J1.E32(GND) J1.E35(GND) J1.E38(GND) J1.E40(GND) J1.F2(GND) J1.F3(GND) J1.F6(GND) J1.F9(GND) J1.F12(GND) J1.F15(GND) J1.F18(GND) J1.F21(GND) J1.F24(GND) J1.F27(GND) J1.F30(GND) J1.F33(GND) J1.F36(GND) J1.F39(GND) J1.G1(GND) J1.G4(GND) J1.G5(GND) J1.G8(GND) J1.G11(GND) J1.G14(GND) J1.G17(GND) J1.G20(GND) J1.G23(GND) J1.G26(GND) J1.G29(GND) J1.G32(GND) J1.G35(GND) J1.G38(GND) J1.G40(GND) J1.H3(GND) J1.H6(GND) J1.H9(GND) J1.H12(GND) J1.H15(GND) J1.H18(GND) J1.H21(GND) J1.H24(GND) J1.H27(GND) J1.H30(GND) J1.H33(GND) J1.H36(GND) J1.H39(GND) J1.J1(GND) J1.J4(GND) J1.J5(GND) J1.J8(GND) J1.J11(GND) J1.J14(GND) J1.J17(GND) J1.J20(GND) J1.J23(GND) J1.J26(GND) J1.J29(GND) J1.J32(GND) J1.J35(GND) J1.J38(GND) J1.J40(GND) J1.K2(GND) J1.K3(GND) J1.K6(GND) J1.K9(GND) J1.K12(GND) J1.K15(GND) J1.K18(GND) J1.K21(GND) J1.K24(GND) J1.K27(GND) J1.K30(GND) J1.K33(GND) J1.K36(GND) J1.K39(GND)
VADJ: J1.E39(VADJ) J1.F40(VADJ) J1.G39(VADJ) J1.H40(VADJ)
VIO_B_M2C: J1.J39(VIO_B_M2C) J1.K40(VIO_B_M2C)
CLK0_M2C_n: J1.H5(CLK0_M2C_N) ; port CLK0_M2C_n
CLK0_M2C_p: J1.H4(CLK0_M2C_P) ; port CLK0_M2C_p
CLK1_M2C_n: J1.G3(CLK1_M2C_N) ; port CLK1_M2C_n
CLK1_M2C_p: J1.G2(CLK1_M2C_P) ; port CLK1_M2C_p
CLK2_BIDIR_n: J1.K5(CLK2_BIDIR_N) ; port CLK2_BIDIR_n
CLK2_BIDIR_p: J1.K4(CLK2_BIDIR_P) ; port CLK2_BIDIR_p
CLK3_BIDIR_n: J1.J3(CLK3_BIDIR_N) ; port CLK3_BIDIR_n
CLK3_BIDIR_p: J1.J2(CLK3_BIDIR_P) ; port CLK3_BIDIR_p
CLK_DIR: J1.B1(CLK_DIR) ; port CLK_DIR
GA0: J1.C34(GA0) ; port GA0
GA1: J1.D35(GA1) ; port GA1
HA00_CC_n: J1.F5(HA00_N_CC) ; port HA00_CC_n
HA00_CC_p: J1.F4(HA00_P_CC) ; port HA00_CC_p
HA01_CC_n: J1.E3(HA01_N_CC) ; port HA01_CC_n
HA01_CC_p: J1.E2(HA01_P_CC) ; port HA01_CC_p
HA02_n: J1.K8(HA02_N) ; port HA02_n
HA02_p: J1.K7(HA02_P) ; port HA02_p
HA03_n: J1.J7(HA03_N) ; port HA03_n
HA03_p: J1.J6(HA03_P) ; port HA03_p
HA04_n: J1.F8(HA04_N) ; port HA04_n
HA04_p: J1.F7(HA04_P) ; port HA04_p
HA05_n: J1.E7(HA05_N) ; port HA05_n
HA05_p: J1.E6(HA05_P) ; port HA05_p
HA06_n: J1.K11(HA06_N) ; port HA06_n
HA06_p: J1.K10(HA06_P) ; port HA06_p
HA07_n: J1.J10(HA07_N) ; port HA07_n
HA07_p: J1.J9(HA07_P) ; port HA07_p
HA08_n: J1.F11(HA08_N) ; port HA08_n
HA08_p: J1.F10(HA08_P) ; port HA08_p
HA09_n: J1.E10(HA09_N) ; port HA09_n
HA09_p: J1.E9(HA09_P) ; port HA09_p
HA10_n: J1.K14(HA10_N) ; port HA10_n
HA10_p: J1.K13(HA10_P) ; port HA10_p
HA11_n: J1.J13(HA11_N) ; port HA11_n
HA11_p: J1.J12(HA11_P) ; port HA11_p
HA12_n: J1.F14(HA13_N) ; port HA12_n
HA12_p: J1.F13(HA13_P) ; port HA12_p
HA13_n: J1.E13(HA13_N) ; port HA13_n
HA13_p: J1.E12(HA13_P) ; port HA13_p
HA14_n: J1.J16(HA14_N) ; port HA14_n
HA14_p: J1.J15(HA14_P) ; port HA14_p
HA15_n: J1.F17(HA15_N) ; port HA15_n
HA15_p: J1.F16(HA15_P) ; port HA15_p
HA16_n: J1.E16(HA16_N) ; port HA16_n
HA16_p: J1.E15(HA16_P) ; port HA16_p
HA17_CC_n: J1.K17(HA17_N) ; port HA17_CC_n
HA17_CC_p: J1.K16(HA17_P) ; port HA17_CC_p
HA18_n: J1.J19(HA18_N) ; port HA18_n
HA18_p: J1.J18(HA18_P) ; port HA18_p
HA19_n: J1.F20(HA19_N) ; port HA19_n
HA19_p: J1.F19(HA19_P) ; port HA19_p
HA20_n: J1.E19(HA20_N) ; port HA20_n
HA20_p: J1.E18(HA20_P) ; port HA20_p
HA21_n: J1.K20(HA21_N) ; port HA21_n
HA21_p: J1.K19(HA21_P) ; port HA21_p
HA22_n: J1.J22(HA22_N) ; port HA22_n
HA22_p: J1.J21(HA22_P) ; port HA22_p
HA23_n: J1.K23(HA23_N) ; port HA23_n
HA23_p: J1.K22(HA23_P) ; port HA23_p
HB00_CC_n: J1.K26(HB00_N_CC) ; port HB00_CC_n
HB00_CC_p: J1.K25(HB00_P_CC) ; port HB00_CC_p
HB01_n: J1.J25(HB01_N) ; port HB01_n
HB01_p: J1.J24(HB01_P) ; port HB01_p
HB02_n: J1.F23(HB02_N) ; port HB02_n
HB02_p: J1.F22(HB02_P) ; port HB02_p
HB03_n: J1.E22(HB03_N) ; port HB03_n
HB03_p: J1.E21(HB03_P) ; port HB03_p
HB04_n: J1.F26(HB04_N) ; port HB04_n
HB04_p: J1.F25(HB04_P) ; port HB04_p
HB05_n: J1.E25(HB05_N) ; port HB05_n
HB05_p: J1.E24(HB05_P) ; port HB05_p
HB06_CC_n: J1.K29(HB06_N_CC) ; port HB06_CC_n
HB06_CC_p: J1.K28(HB06_P_CC) ; port HB06_CC_p
HB07_n: J1.J28(HB07_N) ; port HB07_n
HB07_p: J1.J27(HB07_P) ; port HB07_p
HB08_n: J1.F29(HB08_N) ; port HB08_n
HB08_p: J1.F28(HB08_P) ; port HB08_p
HB09_n: J1.E28(HB09_N) ; port HB09_n
HB09_p: J1.E27(HB09_P) ; port HB09_p
HB10_n: J1.K32(HB10_N) ; port HB10_n
HB10_p: J1.K31(HB10_P) ; port HB10_p
HB11_n: J1.J31(HB11_N) ; port HB11_n
HB11_p: J1.J30(HB11_P) ; port HB11_p
HB12_n: J1.F32(HB12_N) ; port HB12_n
HB12_p: J1.F31(HB12_P) ; port HB12_p
HB13_n: J1.E31(HB13_N) ; port HB13_n
HB13_p: J1.E30(HB13_P) ; port HB13_p
HB14_n: J1.K35(HB14_N) ; port HB14_n
HB14_p: J1.K34(HB14_P) ; port HB14_p
HB15_n: J1.J34(HB15_N) ; port HB15_n
HB15_p: J1.J33(HB15_P) ; port HB15_p
HB16_n: J1.F35(HB16_N) ; port HB16_n
HB16_p: J1.F34(HB16_P) ; port HB16_p
HB17_CC_n: J1.K38(HB17_N) ; port HB17_CC_n
HB17_CC_p: J1.K37(HB17_P) ; port HB17_CC_p
HB18_n: J1.J37(HB18_N) ; port HB18_n
HB18_p: J1.J36(HB18_P) ; port HB18_p
HB19_n: J1.E34(HB19_N) ; port HB19_n
HB19_p: J1.E33(HB19_P) ; port HB19_p
HB20_n: J1.F38(HB20_N) ; port HB20_n
HB20_p: J1.F37(HB20_P) ; port HB20_p
HB21_n: J1.E37(HB21_N) ; port HB21_n
HB21_p: J1.E36(HB21_P) ; port HB21_p
JTAG_TCK: J1.D29(TCK) ; port JTAG_TCK
JTAG_TDI: J1.D30(TDI) ; port JTAG_TDI
JTAG_TDO: J1.D31(TDO) ; port JTAG_TDO
JTAG_TMS: J1.D33(TMS) ; port JTAG_TMS
LA00_CC_n: J1.G7(LA00_N_CC) ; port LA00_CC_n
LA00_CC_p: J1.G6(LA00_P_CC) ; port LA00_CC_p
LA01_CC_n: J1.D9(LA01_N_CC) ; port LA01_CC_n
LA01_CC_p: J1.D8(LA01_P_CC) ; port LA01_CC_p
LA02_n: J1.H8(LA02_N_CC) ; port LA02_n
LA02_p: J1.H7(LA02_P_CC) ; port LA02_p
LA03_n: J1.G10(LA03_N_CC) ; port LA03_n
LA03_p: J1.G9(LA03_P_CC) ; port LA03_p
LA04_n: J1.H11(LA04_N_CC) ; port LA04_n
LA04_p: J1.H10(LA04_P_CC) ; port LA04_p
LA05_n: J1.D12(LA05_N_CC) ; port LA05_n
LA05_p: J1.D11(LA05_P_CC) ; port LA05_p
LA06_n: J1.C11(LA06_N) ; port LA06_n
LA06_p: J1.C10(LA06_P) ; port LA06_p
LA07_n: J1.H14(LA07_N_CC) ; port LA07_n
LA07_p: J1.H13(LA07_P_CC) ; port LA07_p
LA08_n: J1.G13(LA08_N_CC) ; port LA08_n
LA08_p: J1.G12(LA08_P_CC) ; port LA08_p
LA09_n: J1.D15(LA09_N_CC) ; port LA09_n
LA09_p: J1.D14(LA09_P_CC) ; port LA09_p
LA10_n: J1.C15(LA10_N_CC) ; port LA10_n
LA10_p: J1.C14(LA10_P_CC) ; port LA10_p
LA11_n: J1.H17(LA11_N_CC) ; port LA11_n
LA11_p: J1.H16(LA11_P_CC) ; port LA11_p
LA12_n: J1.G16(LA12_N_CC) ; port LA12_n
LA12_p: J1.G15(LA12_P_CC) ; port LA12_p
LA13_n: J1.D18(LA13_N_CC) ; port LA13_n
LA13_p: J1.D17(LA13_P_CC) ; port LA13_p
LA14_n: J1.C19(LA14_P_CC) ; port LA14_n
LA14_p: J1.C18(LA14_P_CC) ; port LA14_p
LA15_n: J1.H20(LA15_N_CC) ; port LA15_n
LA15_p: J1.H19(LA15_P_CC) ; port LA15_p
LA16_n: J1.G19(LA16_N_CC) ; port LA16_n
LA16_p: J1.G18(LA16_P_CC) ; port LA16_p
LA17_CC_n: J1.D21(LA17_N_CC) ; port LA17_CC_n
LA17_CC_p: J1.D20(LA17_P_CC) ; port LA17_CC_p
LA18_CC_n: J1.C23(LA18_N_CC) ; port LA18_CC_n
LA18_CC_p: J1.C22(LA18_P_CC) ; port LA18_CC_p
LA19_n: J1.H23(LA19_N_CC) ; port LA19_n
LA19_p: J1.H22(LA19_P_CC) ; port LA19_p
LA20_n: J1.G22(LA20_N_CC) ; port LA20_n
LA20_p: J1.G21(LA20_P_CC) ; port LA20_p
LA21_n: J1.H26(LA21_N_CC) ; port LA21_n
LA21_p: J1.H25(LA21_P_CC) ; port LA21_p
LA22_n: J1.G25(LA22_N_CC) ; port LA22_n
LA22_p: J1.G24(LA22_P_CC) ; port LA22_p
LA23_n: J1.D24(LA23_N_CC) ; port LA23_n
LA23_p: J1.D23(LA23_P_CC) ; port LA23_p
LA24_n: J1.H29(LA24_N_CC) ; port LA24_n
LA24_p: J1.H28(LA24_P_CC) ; port LA24_p
LA25_n: J1.G28(LA25_N_CC) ; port LA25_n
LA25_p: J1.G27(LA25_P_CC) ; port LA25_p
LA26_n: J1.D27(LA26_N_CC) ; port LA26_n
LA26_p: J1.D26(LA26_P_CC) ; port LA26_p
LA27_n: J1.C27(LA27_N_CC) ; port LA27_n
LA27_p: J1.C26(LA27_P_CC) ; port LA27_p
LA28_n: J1.H32(LA28_N_CC) ; port LA28_n
LA28_p: J1.H31(LA28_P_CC) ; port LA28_p
LA29_n: J1.G31(LA29_N_CC) ; port LA29_n
LA29_p: J1.G30(LA29_P_CC) ; port LA29_p
LA30_n: J1.H35(LA30_N_CC) ; port LA30_n
LA30_p: J1.H34(LA30_P_CC) ; port LA30_p
LA31_n: J1.G34(LA31_N_CC) ; port LA31_n
LA31_p: J1.G33(LA31_P_CC) ; port LA31_p
LA32_n: J1.H38(LA32_N_CC) ; port LA32_n
LA32_p: J1.H37(LA32_P_CC) ; port LA32_p
LA33_n: J1.G37(LA33_N_CC) ; port LA33_n
LA33_p: J1.G36(LA33_P_CC) ; port LA33_p
PG_C2M: J1.D1(PG_C2M) ; port PG_C2M
PG_M2C: J1.F1(PG_M2C) ; port PG_M2C
PRST#: J1.H2(PRSNT_M2C_L) ; port PRST#
SCL: J1.C30(SCL) ; port SCL
SDA: J1.C31(SDA) ; port SDA
VREF_A: J1.H1(VREF_A_M2C) ; port VREF_A
VREF_B: J1.K1(VREF_B_M2C) ; port VREF_B

Not connected (* = marked no-connect by the designer): J1 A2(DP1_M2C_P)* A3(DP1_M2C_N)* A6(DP2_M2C_P)* A7(DP2_M2C_N)* A10(DP3_M2C_P)* A11(DP3_M2C_N)* A14(DP4_M2C_P)* A15(DP4_M2C_N)* A18(DP5_M2C_P)* A19(DP5_M2C_N)* A22(DP1_C2M_P)* A23(DP1_C2M_N)* A26(DP2_C2M_P)* A27(DP2_C2M_N)* A30(DP3_C2M_P)* A31(DP3_C2M_N)* A34(DP4_C2M_P)* A35(DP4_C2M_N)* A38(DP5_C2M_P)* A39(DP5_C2M_P)* B4(DP9_M2C_P)* B5(DP9_M2C_N)* B8(DP8_M2C_P)* B9(DP8_M2C_N)* B12(DP7_M2C_P)* B13(DP7_M2C_N)* B16(DP6_M2C_P)* B17(DP6_M2C_N)* B20(GBT_CLK1_M2C_P)* B21(GBT_CLK1_M2C_N)* B24(DP9_C2M_P)* B25(DP9_C2M_N)* B28(DP8_C2M_P) B29(DP8_C2M_N) B32(DP7_C2M_P)* B33(DP7_C2M_N)* B36(DP6_C2M_P)* B37(DP6_C2M_N)* B40(RES0)* C2(DP0_C2M_P)* C3(DP0_C2M_N)* C6(DP0_M2C_P)* C7(DP0_M2C_N)* D4(GBT_CLK0_M2C_P)* D5(GBT_CLK0_M2C_N)* D34(~{TRS}T)*

### Layout directives
differential pair; differential pair class DIFF_PAIR: CLK0_M2C_n, CLK0_M2C_p, CLK1_M2C_n, CLK1_M2C_p, HA00_CC_n, HA00_CC_p, HA01_CC_n, HA01_CC_p, HA02_n, HA02_p, HA03_n, HA03_p, HA04_n, HA04_p, HA05_n, HA05_p, HA06_n, HA06_p, HA07_n, HA07_p, HA08_n, HA08_p, HA09_n, HA09_p, HA10_n, HA10_p, HA11_n, HA11_p, HA12_n, HA12_p, HA13_n, HA13_p, HA14_n, HA14_p, HA15_n, HA15_p, HA16_n, HA16_p, HA17_CC_n, HA17_CC_p, HA18_n, HA18_p, HA19_n, HA19_p, HA20_n, HA20_p, HA21_n, HA21_p, HA22_n, HA22_p, HA23_n, HA23_p, HB00_CC_n, HB00_CC_p, HB01_n, HB01_p, HB02_n, HB02_p, HB03_n, HB03_p, HB04_n, HB04_p, HB05_n, HB05_p, HB06_CC_n, HB06_CC_p, HB07_n, HB07_p, HB08_n, HB08_p, HB09_n, HB09_p, HB10_n, HB10_p, HB11_n, HB11_p, HB12_n, HB12_p, HB13_n, HB13_p, HB14_n, HB14_p, HB15_n, HB15_p, HB16_n, HB16_p, HB17_CC_n, HB17_CC_p, HB18_n, HB18_p, HB19_n, HB19_p, HB20_n, HB20_p, HB21_n, HB21_p, LA00_CC_n, LA00_CC_p, LA01_CC_n, LA01_CC_p, LA02_n, LA02_p, LA03_n, LA03_p, LA04_n, LA04_p, LA05_n, LA05_p, LA06_n, LA06_p, LA07_n, LA07_p, LA08_n, LA08_p, LA09_n, LA09_p, LA10_n, LA10_p, LA11_n, LA11_p, LA12_n, LA12_p, LA13_n, LA13_p, LA14_n, LA14_p, LA15_n, LA15_p, LA16_n, LA16_p, LA17_CC_n, LA17_CC_p, LA18_CC_n, LA18_CC_p, LA19_n, LA19_p, LA20_n, LA20_p, LA21_n, LA21_p, LA22_n, LA22_p, LA23_n, LA23_p, LA24_n, LA24_p, LA25_n, LA25_p, LA26_n, LA26_p, LA27_n, LA27_p, LA28_n, LA28_p, LA29_n, LA29_p, LA30_n, LA30_p, LA31_n, LA31_p, LA32_n, LA32_p, LA33_n, LA33_p
differential pair: CLK2_BIDIR_n, CLK2_BIDIR_p, CLK3_BIDIR_n, CLK3_BIDIR_p

### Notes on the sheet
- Sheet Name
- Project Title
- Global Project
- Size
- Group
- Revision
- Date
- Sheet
- of
- Filename
- Designers

### Library data of the parts
J1 = CONN_SAMTEC_ASP-134488-01: CONN - VITA 57 MEZZ MALE (DAUGHTERBOARD) HIGH DENSITY - SMD-400; Voltage: 240VAC; Current: 1.8A; Mfg: Samtec; Power: *; Mfg Part Number: ASP-134488-01; HelpURL: http://suddendocs.samtec.com/prints/asp-134488-01-mkt.pdf; CreatedBy: Jonathan Bouchard; Temperature: -55 °C to +125 °C; Value: *; Precision: *; Package: SMD-400

## Sheet S7CAS-PLEIADES-CARTE-MERE_P02_FPGA_B0B1.SchDoc
size Tabloid; DocumentNumber: 5; SheetNumber: 5; SheetTotal: 14; Size: 11x17; Sheet_Name: FPGA Bank0-1
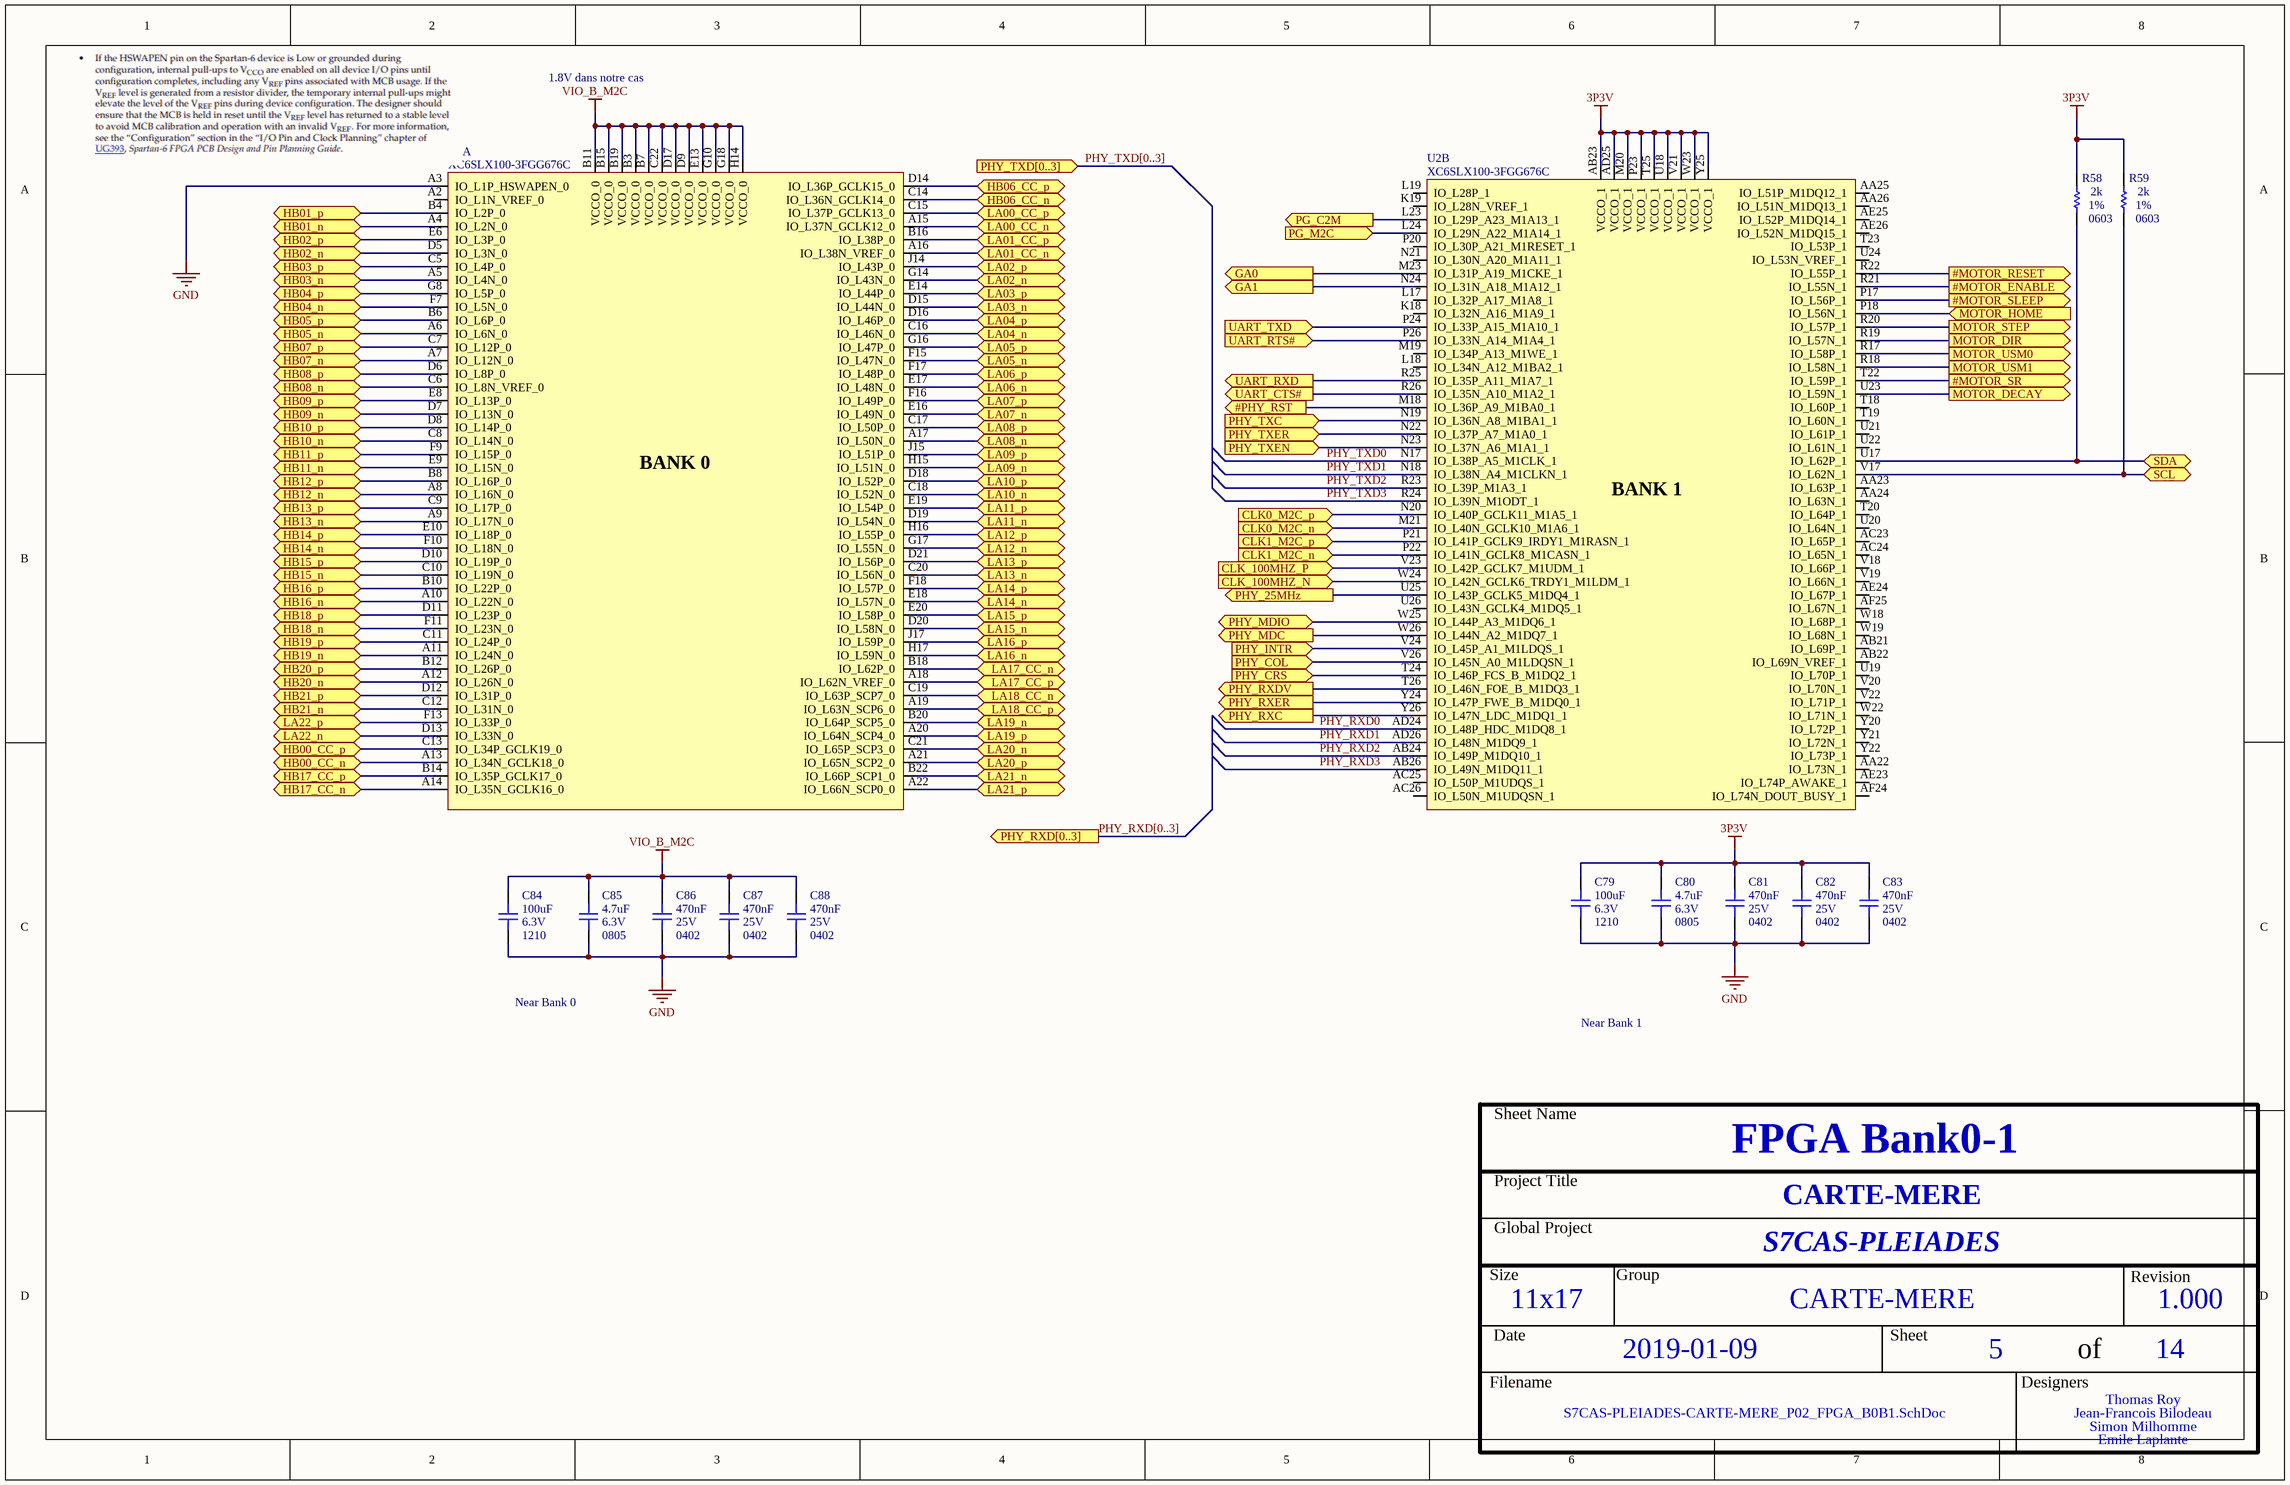
[diagram p3: S7CAS-PLEIADES-CARTE-MERE_P02_FPGA_B0B1.SchDoc]

### Parts
C79  value 100uF  Voltage: 6.3V  Package: 1210  [CAP_1210]  (hidden comment: CAP - 1210)
C80  value 4.7uF  Voltage: 6.3V  Package: 0805  [CAP_0805]  (hidden comment: CAP - 0805)
C81  value 470nF  Voltage: 25V  Package: 0402  [CAP_0402]  (hidden comment: CAP - 0402)
C82  value 470nF  Voltage: 25V  Package: 0402  [CAP_0402]  (hidden comment: CAP - 0402)
C83  value 470nF  Voltage: 25V  Package: 0402  [CAP_0402]  (hidden comment: CAP - 0402)
C84  value 100uF  Voltage: 6.3V  Package: 1210  [CAP_1210]  (hidden comment: CAP - 1210)
C85  value 4.7uF  Voltage: 6.3V  Package: 0805  [CAP_0805]  (hidden comment: CAP - 0805)
C86  value 470nF  Voltage: 25V  Package: 0402  [CAP_0402]  (hidden comment: CAP - 0402)
C87  value 470nF  Voltage: 25V  Package: 0402  [CAP_0402]  (hidden comment: CAP - 0402)
C88  value 470nF  Voltage: 25V  Package: 0402  [CAP_0402]  (hidden comment: CAP - 0402)
R58  value 2k  Package: 0603  Precision: 1%  [RES_0603]  (hidden comment: RES - 0603)
R59  value 2k  Package: 0603  Precision: 1%  [RES_0603]  (hidden comment: RES - 0603)
U2  XC6SLX100-3FGG676C  [FPGA_XILINX_FGG676]  (parts A,B of 10)

### Ports
#MOTOR_ENABLE (out), #MOTOR_RESET (out), #MOTOR_SLEEP (out), #MOTOR_SR (out), #PHY_RST (out), CLK0_M2C_n (in), CLK0_M2C_p (in), CLK1_M2C_n (in), CLK1_M2C_p (in), CLK_100MHZ_N (in), CLK_100MHZ_P (in), GA0 (out), GA1 (out), HB00_CC_n (bidir), HB00_CC_p (bidir), HB01_n (bidir), HB01_p (bidir), HB02_n (bidir), HB02_p (bidir), HB03_n (bidir), HB03_p (bidir), HB04_n (bidir), HB04_p (bidir), HB05_n (bidir), HB05_p (bidir), HB06_CC_n (bidir), HB06_CC_p (bidir), HB07_n (bidir), HB07_p (bidir), HB08_n (bidir), HB08_p (bidir), HB09_n (bidir), HB09_p (bidir), HB10_n (bidir), HB10_p (bidir), HB11_n (bidir), HB11_p (bidir), HB12_n (bidir), HB12_p (bidir), HB13_n (bidir), HB13_p (bidir), HB14_n (bidir), HB14_p (bidir), HB15_n (bidir), HB15_p (bidir), HB16_n (bidir), HB16_p (bidir), HB17_CC_n (bidir), HB17_CC_p (bidir), HB18_n (bidir), HB18_p (bidir), HB19_n (bidir), HB19_p (bidir), HB20_n (bidir), HB20_p (bidir), HB21_n (bidir), HB21_p (bidir), LA00_CC_n (bidir), LA00_CC_p (bidir), LA01_CC_n (bidir), LA01_CC_p (bidir), LA02_n (bidir), LA02_p (bidir), LA03_n (bidir), LA03_p (bidir), LA04_n (bidir), LA04_p (bidir), LA05_n (bidir), LA05_p (bidir), LA06_n (bidir), LA06_p (bidir), LA07_n (bidir), LA07_p (bidir), LA08_n (bidir), LA08_p (bidir), LA09_n (bidir), LA09_p (bidir), LA10_n (bidir), LA10_p (bidir), LA11_n (bidir), LA11_p (bidir), LA12_n (bidir), LA12_p (bidir), LA13_n (bidir), LA13_p (bidir), LA14_n (bidir), LA14_p (bidir), LA15_n (bidir), LA15_p (bidir), LA16_n (bidir), LA16_p (bidir), LA17_CC_n (bidir), LA17_CC_p (bidir), LA18_CC_n (bidir), LA18_CC_p (bidir), LA19_n (bidir), LA19_p (bidir), LA20_n (bidir), LA20_p (bidir), LA21_n (bidir), LA21_p (bidir), LA22_n (bidir), LA22_p (bidir), MOTOR_DECAY (out), MOTOR_DIR (out), MOTOR_HOME (in), MOTOR_STEP (out), MOTOR_USM0 (out), MOTOR_USM1 (out), PG_C2M (out), PG_M2C (in), PHY_25MHz (out), PHY_COL (in), PHY_CRS (in), PHY_INTR (in), PHY_MDC (out), PHY_MDIO (bidir), PHY_RXC (out), PHY_RXD[0..3] (out), PHY_RXDV (out), PHY_RXER (out), PHY_TXC (in), PHY_TXD[0..3] (in), PHY_TXEN (in), PHY_TXER (in), SCL (bidir), SDA (bidir), UART_CTS# (out), UART_RTS# (in), UART_RXD (out), UART_TXD (in)

### Nets
3P3V: C79.2 C80.2 C81.2 C82.2 C83.2 R58.2 R59.2 U2.AB23(VCCO_1) U2.AD25(VCCO_1) U2.M20(VCCO_1) U2.P23(VCCO_1) U2.T25(VCCO_1) U2.U18(VCCO_1) U2.V21(VCCO_1) U2.W23(VCCO_1) U2.Y25(VCCO_1)
GND: C79.1 C80.1 C81.1 C82.1 C83.1 C84.1 C85.1 C86.1 C87.1 C88.1 U2.A3(IO_L1P_HSWAPEN_0)
VIO_B_M2C: C84.2 C85.2 C86.2 C87.2 C88.2 U2.B3(VCCO_0) U2.B7(VCCO_0) U2.B11(VCCO_0) U2.B15(VCCO_0) U2.B19(VCCO_0) U2.C22(VCCO_0) U2.D9(VCCO_0) U2.D17(VCCO_0) U2.E13(VCCO_0) U2.G10(VCCO_0) U2.G18(VCCO_0) U2.H14(VCCO_0)
#MOTOR_ENABLE: U2.R21(IO_L55N_1) ; port #MOTOR_ENABLE
#MOTOR_RESET: U2.R22(IO_L55P_1) ; port #MOTOR_RESET
#MOTOR_SLEEP: U2.P17(IO_L56P_1) ; port #MOTOR_SLEEP
#MOTOR_SR: U2.T22(IO_L59P_1) ; port #MOTOR_SR
#PHY_RST: U2.M18(IO_L36P_A9_M1BA0_1) ; port #PHY_RST
CLK0_M2C_n: U2.M21(IO_L40N_GCLK10_M1A6_1) ; port CLK0_M2C_n
CLK0_M2C_p: U2.N20(IO_L40P_GCLK11_M1A5_1) ; port CLK0_M2C_p
CLK1_M2C_n: U2.P22(IO_L41N_GCLK8_M1CASN_1) ; port CLK1_M2C_n
CLK1_M2C_p: U2.P21(IO_L41P_GCLK9_IRDY1_M1RASN_1) ; port CLK1_M2C_p
CLK_100MHZ_N: U2.W24(IO_L42N_GCLK6_TRDY1_M1LDM_1) ; port CLK_100MHZ_N
CLK_100MHZ_P: U2.V23(IO_L42P_GCLK7_M1UDM_1) ; port CLK_100MHZ_P
GA0: U2.M23(IO_L31P_A19_M1CKE_1) ; port GA0
GA1: U2.N24(IO_L31N_A18_M1A12_1) ; port GA1
HB00_CC_n: U2.A13(IO_L34N_GCLK18_0) ; port HB00_CC_n
HB00_CC_p: U2.C13(IO_L34P_GCLK19_0) ; port HB00_CC_p
HB01_n: U2.A4(IO_L2N_0) ; port HB01_n
HB01_p: U2.B4(IO_L2P_0) ; port HB01_p
HB02_n: U2.D5(IO_L3N_0) ; port HB02_n
HB02_p: U2.E6(IO_L3P_0) ; port HB02_p
HB03_n: U2.A5(IO_L4N_0) ; port HB03_n
HB03_p: U2.C5(IO_L4P_0) ; port HB03_p
HB04_n: U2.F7(IO_L5N_0) ; port HB04_n
HB04_p: U2.G8(IO_L5P_0) ; port HB04_p
HB05_n: U2.A6(IO_L6N_0) ; port HB05_n
HB05_p: U2.B6(IO_L6P_0) ; port HB05_p
HB06_CC_n: U2.C14(IO_L36N_GCLK14_0) ; port HB06_CC_n
HB06_CC_p: U2.D14(IO_L36P_GCLK15_0) ; port HB06_CC_p
HB07_n: U2.A7(IO_L12N_0) ; port HB07_n
HB07_p: U2.C7(IO_L12P_0) ; port HB07_p
HB08_n: U2.C6(IO_L8N_VREF_0) ; port HB08_n
HB08_p: U2.D6(IO_L8P_0) ; port HB08_p
HB09_n: U2.D7(IO_L13N_0) ; port HB09_n
HB09_p: U2.E8(IO_L13P_0) ; port HB09_p
HB10_n: U2.C8(IO_L14N_0) ; port HB10_n
HB10_p: U2.D8(IO_L14P_0) ; port HB10_p
HB11_n: U2.E9(IO_L15N_0) ; port HB11_n
HB11_p: U2.F9(IO_L15P_0) ; port HB11_p
HB12_n: U2.A8(IO_L16N_0) ; port HB12_n
HB12_p: U2.B8(IO_L16P_0) ; port HB12_p
HB13_n: U2.A9(IO_L17N_0) ; port HB13_n
HB13_p: U2.C9(IO_L17P_0) ; port HB13_p
HB14_n: U2.F10(IO_L18N_0) ; port HB14_n
HB14_p: U2.E10(IO_L18P_0) ; port HB14_p
HB15_n: U2.C10(IO_L19N_0) ; port HB15_n
HB15_p: U2.D10(IO_L19P_0) ; port HB15_p
HB16_n: U2.A10(IO_L22N_0) ; port HB16_n
HB16_p: U2.B10(IO_L22P_0) ; port HB16_p
HB17_CC_n: U2.A14(IO_L35N_GCLK16_0) ; port HB17_CC_n
HB17_CC_p: U2.B14(IO_L35P_GCLK17_0) ; port HB17_CC_p
HB18_n: U2.F11(IO_L23N_0) ; port HB18_n
HB18_p: U2.D11(IO_L23P_0) ; port HB18_p
HB19_n: U2.A11(IO_L24N_0) ; port HB19_n
HB19_p: U2.C11(IO_L24P_0) ; port HB19_p
HB20_n: U2.A12(IO_L26N_0) ; port HB20_n
HB20_p: U2.B12(IO_L26P_0) ; port HB20_p
HB21_n: U2.C12(IO_L31N_0) ; port HB21_n
HB21_p: U2.D12(IO_L31P_0) ; port HB21_p
LA00_CC_n: U2.A15(IO_L37N_GCLK12_0) ; port LA00_CC_n
LA00_CC_p: U2.C15(IO_L37P_GCLK13_0) ; port LA00_CC_p
LA01_CC_n: U2.A16(IO_L38N_VREF_0) ; port LA01_CC_n
LA01_CC_p: U2.B16(IO_L38P_0) ; port LA01_CC_p
LA02_n: U2.G14(IO_L43N_0) ; port LA02_n
LA02_p: U2.J14(IO_L43P_0) ; port LA02_p
LA03_n: U2.D15(IO_L44N_0) ; port LA03_n
LA03_p: U2.E14(IO_L44P_0) ; port LA03_p
LA04_n: U2.C16(IO_L46N_0) ; port LA04_n
LA04_p: U2.D16(IO_L46P_0) ; port LA04_p
LA05_n: U2.F15(IO_L47N_0) ; port LA05_n
LA05_p: U2.G16(IO_L47P_0) ; port LA05_p
LA06_n: U2.E17(IO_L48N_0) ; port LA06_n
LA06_p: U2.F17(IO_L48P_0) ; port LA06_p
LA07_n: U2.E16(IO_L49N_0) ; port LA07_n
LA07_p: U2.F16(IO_L49P_0) ; port LA07_p
LA08_n: U2.A17(IO_L50N_0) ; port LA08_n
LA08_p: U2.C17(IO_L50P_0) ; port LA08_p
LA09_n: U2.H15(IO_L51N_0) ; port LA09_n
LA09_p: U2.J15(IO_L51P_0) ; port LA09_p
LA10_n: U2.C18(IO_L52N_0) ; port LA10_n
LA10_p: U2.D18(IO_L52P_0) ; port LA10_p
LA11_n: U2.D19(IO_L54N_0) ; port LA11_n
LA11_p: U2.E19(IO_L54P_0) ; port LA11_p
LA12_n: U2.G17(IO_L55N_0) ; port LA12_n
LA12_p: U2.H16(IO_L55P_0) ; port LA12_p
LA13_n: U2.C20(IO_L56N_0) ; port LA13_n
LA13_p: U2.D21(IO_L56P_0) ; port LA13_p
LA14_n: U2.E18(IO_L57N_0) ; port LA14_n
LA14_p: U2.F18(IO_L57P_0) ; port LA14_p
LA15_n: U2.D20(IO_L58N_0) ; port LA15_n
LA15_p: U2.E20(IO_L58P_0) ; port LA15_p
LA16_n: U2.H17(IO_L59N_0) ; port LA16_n
LA16_p: U2.J17(IO_L59P_0) ; port LA16_p
LA17_CC_n: U2.B18(IO_L62P_0) ; port LA17_CC_n
LA17_CC_p: U2.A18(IO_L62N_VREF_0) ; port LA17_CC_p
LA18_CC_n: U2.C19(IO_L63P_SCP7_0) ; port LA18_CC_n
LA18_CC_p: U2.A19(IO_L63N_SCP6_0) ; port LA18_CC_p
LA19_n: U2.B20(IO_L64P_SCP5_0) ; port LA19_n
LA19_p: U2.A20(IO_L64N_SCP4_0) ; port LA19_p
LA20_n: U2.C21(IO_L65P_SCP3_0) ; port LA20_n
LA20_p: U2.A21(IO_L65N_SCP2_0) ; port LA20_p
LA21_n: U2.B22(IO_L66P_SCP1_0) ; port LA21_n
LA21_p: U2.A22(IO_L66N_SCP0_0) ; port LA21_p
LA22_n: U2.D13(IO_L33N_0) ; port LA22_n
LA22_p: U2.F13(IO_L33P_0) ; port LA22_p
MOTOR_DECAY: U2.U23(IO_L59N_1) ; port MOTOR_DECAY
MOTOR_DIR: U2.R19(IO_L57N_1) ; port MOTOR_DIR
MOTOR_HOME: U2.P18(IO_L56N_1) ; port MOTOR_HOME
MOTOR_STEP: U2.R20(IO_L57P_1) ; port MOTOR_STEP
MOTOR_USM0: U2.R17(IO_L58P_1) ; port MOTOR_USM0
MOTOR_USM1: U2.R18(IO_L58N_1) ; port MOTOR_USM1
PG_C2M: U2.L23(IO_L29P_A23_M1A13_1) ; port PG_C2M
PG_M2C: U2.L24(IO_L29N_A22_M1A14_1) ; port PG_M2C
PHY_25MHz: U2.U25(IO_L43P_GCLK5_M1DQ4_1) ; port PHY_25MHz
PHY_COL: U2.V26(IO_L45N_A0_M1LDQSN_1) ; port PHY_COL
PHY_CRS: U2.T24(IO_L46P_FCS_B_M1DQ2_1) ; port PHY_CRS
PHY_INTR: U2.V24(IO_L45P_A1_M1LDQS_1) ; port PHY_INTR
PHY_MDC: U2.W26(IO_L44N_A2_M1DQ7_1) ; port PHY_MDC
PHY_MDIO: U2.W25(IO_L44P_A3_M1DQ6_1) ; port PHY_MDIO
PHY_RXC: U2.Y26(IO_L47N_LDC_M1DQ1_1) ; port PHY_RXC
PHY_RXD0: U2.AD24(IO_L48P_HDC_M1DQ8_1)
PHY_RXD1: U2.AD26(IO_L48N_M1DQ9_1)
PHY_RXD2: U2.AB24(IO_L49P_M1DQ10_1)
PHY_RXD3: U2.AB26(IO_L49N_M1DQ11_1)
PHY_RXDV: U2.T26(IO_L46N_FOE_B_M1DQ3_1) ; port PHY_RXDV
PHY_RXER: U2.Y24(IO_L47P_FWE_B_M1DQ0_1) ; port PHY_RXER
PHY_TXC: U2.N19(IO_L36N_A8_M1BA1_1) ; port PHY_TXC
PHY_TXD0: U2.N17(IO_L38P_A5_M1CLK_1)
PHY_TXD1: U2.N18(IO_L38N_A4_M1CLKN_1)
PHY_TXD2: U2.R23(IO_L39P_M1A3_1)
PHY_TXD3: U2.R24(IO_L39N_M1ODT_1)
PHY_TXEN: U2.N23(IO_L37N_A6_M1A1_1) ; port PHY_TXEN
PHY_TXER: U2.N22(IO_L37P_A7_M1A0_1) ; port PHY_TXER
SCL: R59.1 U2.V17(IO_L62N_1) ; port SCL
SDA: R58.1 U2.U17(IO_L62P_1) ; port SDA
UART_CTS#: U2.R26(IO_L35N_A10_M1A2_1) ; port UART_CTS#
UART_RTS#: U2.P26(IO_L33N_A14_M1A4_1) ; port UART_RTS#
UART_RXD: U2.R25(IO_L35P_A11_M1A7_1) ; port UART_RXD
UART_TXD: U2.P24(IO_L33P_A15_M1A10_1) ; port UART_TXD

Not connected (* = marked no-connect by the designer): U2 A2(IO_L1N_VREF_0) AA22(IO_L73N_1) AA23(IO_L63P_1) AA24(IO_L63N_1) AA25(IO_L51P_M1DQ12_1) AA26(IO_L51N_M1DQ13_1) AB21(IO_L69P_1) AB22(IO_L69N_VREF_1) AC23(IO_L65P_1) AC24(IO_L65N_1) AC25(IO_L50P_M1UDQS_1) AC26(IO_L50N_M1UDQSN_1) AE23(IO_L74P_AWAKE_1) AE24(IO_L67P_1) AE25(IO_L52P_M1DQ14_1) AE26(IO_L52N_M1DQ15_1) AF24(IO_L74N_DOUT_BUSY_1) AF25(IO_L67N_1) K18(IO_L32N_A16_M1A9_1) K19(IO_L28N_VREF_1) L17(IO_L32P_A17_M1A8_1) L18(IO_L34N_A12_M1BA2_1) L19(IO_L28P_1) M19(IO_L34P_A13_M1WE_1) N21(IO_L30N_A20_M1A11_1) P20(IO_L30P_A21_M1RESET_1) T18(IO_L60P_1) T19(IO_L60N_1) T20(IO_L64P_1) T23(IO_L53P_1) U19(IO_L70P_1) U20(IO_L64N_1) U21(IO_L61P_1) U22(IO_L61N_1) U24(IO_L53N_VREF_1) U26(IO_L43N_GCLK4_M1DQ5_1) V18(IO_L66P_1) V19(IO_L66N_1) V20(IO_L70N_1) V22(IO_L71P_1) W18(IO_L68P_1) W19(IO_L68N_1) W22(IO_L71N_1) Y20(IO_L72P_1) Y21(IO_L72N_1) Y22(IO_L73P_1)

### Buses and harness runs
bus PHY_RXD[0..3] = port PHY_RXD[0..3]
bus PHY_TXD[0..3] = port PHY_TXD[0..3]

### Notes on the sheet
- 1.8V dans notre cas
- Near Bank 0
- Near Bank 1
- Sheet Name
- Project Title
- Global Project
- Size
- Group
- Revision
- Date
- Sheet
- of
- Filename
- Designers
- (in symbol FPGA_XC6SLX100-3FGG676C, part A) BANK 0
- (in symbol FPGA_XC6SLX100-3FGG676C, part B) BANK 1

### Library data of the parts
C79 C84 = CAP - 1210: Precision: 10%; Current: *; CreatedBy: Jonathan Bouchard; Power: *
C80 C85 = CAP - 0805: Precision: 10%; Current: *; CreatedBy: Jonathan Bouchard; Power: *
C81-C83 C86-C88 = CAP - 0402: Precision: 10%; Current: *; CreatedBy: Jonathan Bouchard; Power: *
U2 = FPGA_XC6SLX100-3FGG676C: FPGA - XILINX SPARTAN 6 480 I/O - BGA-676; Voltage: 1.14 V ~ 1.26 V; Current: *; Power: *; Mfg: Xilinx; Mfg Part Number: XC6SLX100-3FGG676C; HelpURL: https://www.xilinx.com/support/documentation/data_sheets/ds162.pdf; CreatedBy: Jonathan Bouchard; Temperature: 0°C ~ 85°C (TJ); Value: *; Precision: *; Package: BGA-676; Supplier 1: Digikey; Supplier Part Number 1: 122-1760-ND
R58 R59 = RES - 0603: Current: *; CreatedBy: Jonathan Bouchard